# Altium project KATADC_V1-3.PrjPCB (part 1 of 3)
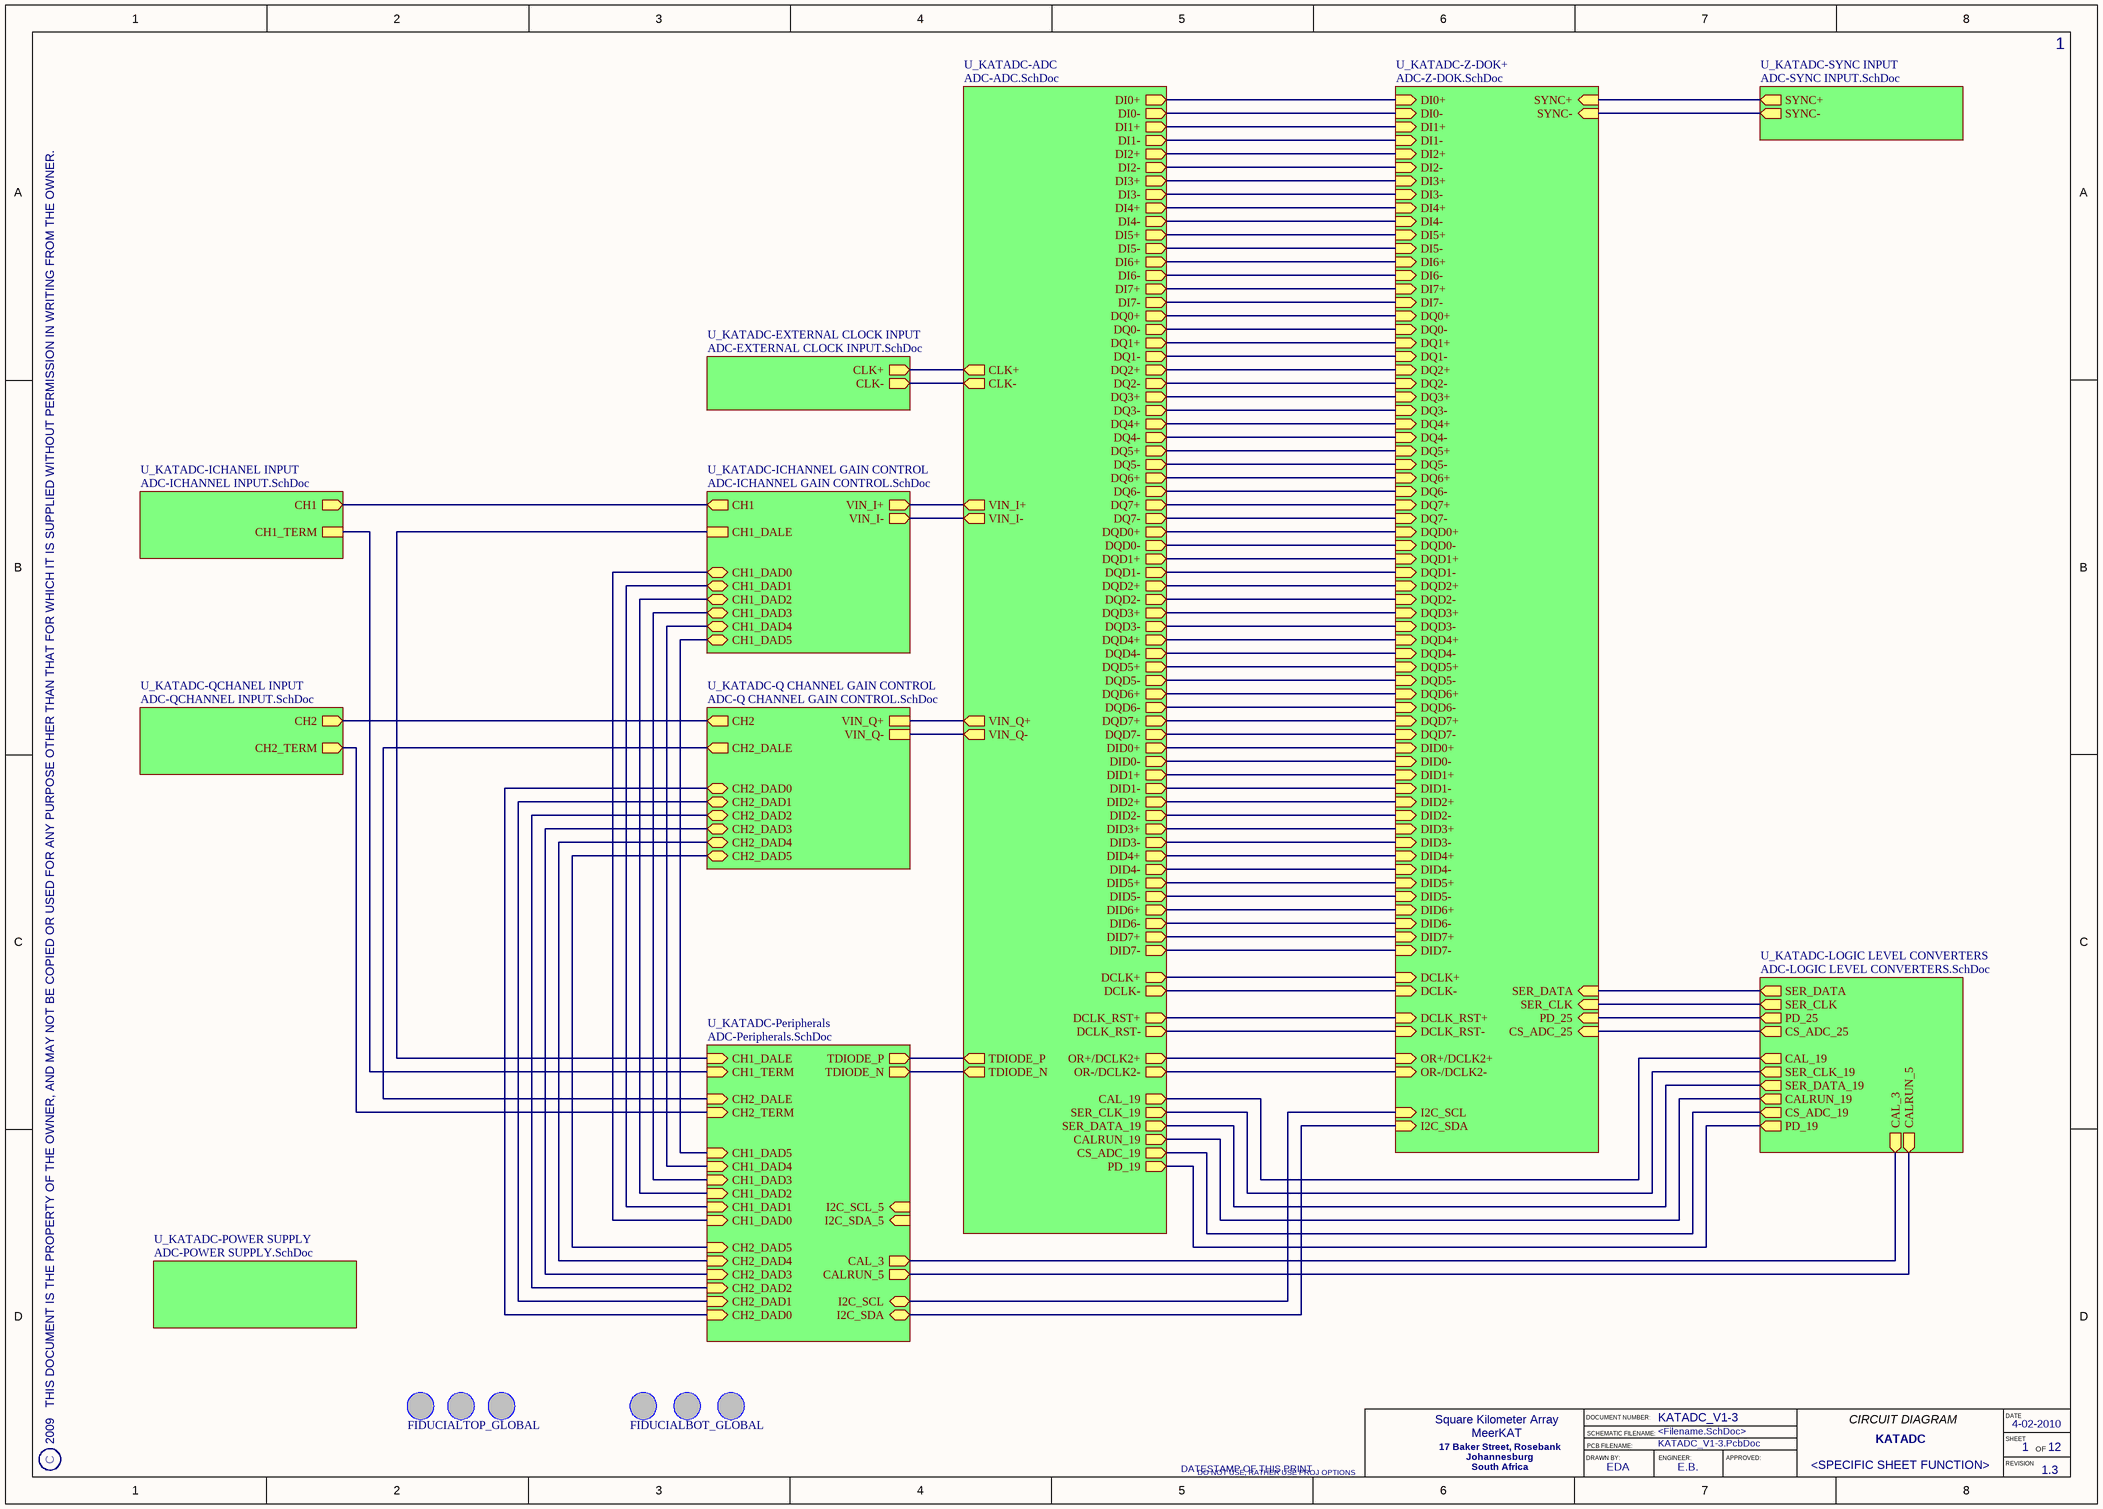
[diagram p0: ADC-TopSheet.SchDoc]
COMPANY_ADDRESS_1: 17 Baker Street, Rosebank; COMPANY_ADDRESS_2: Johannesburg; COMPANY_ADDRESS_3: South Africa; COMPANY_NAME1: Square Kilometer Array; COMPANY_NAME2: MeerKAT; COPYRIGHT_YEAR: 2010; GERBER FILENAME: KATADC_V1-3; PCB_REVISION: 1.3; PCB_Title_Date: 01-06-2010; PCB_Title_Description: SKA ADC PCB; PCB_Title_DocumentNumber: KATADC_V1-3; PCB_Title_DrawnBy: EDA; PCB_Title_Engineer: E.B.; PCB_Title_Filename: KATADC_V1-3.PcbDoc; PROJECT_Filename: KATADC_V1-3.PrjPCB; PROJECT_TITLE: KATADC; SCH_Title_Date: 4-02-2010; SCH_Title_DocumentNumber: KATADC_V1-3; SCH_Title_DrawnBy: EDA; SCH_Title_Engineer: E.B.
12 sheets, 188 parts. Net scope: hierarchical (ports join the sheet entries above them; power ports are global).
Board file: KATADC_V1-3.PcbDoc
Sheets:
  ADC-TopSheet.SchDoc
    U_KATADC-EXTERNAL CLOCK INPUT = ADC-EXTERNAL CLOCK INPUT.SchDoc
    U_KATADC-ICHANEL INPUT = ADC-ICHANNEL INPUT.SchDoc
    U_KATADC-ICHANNEL GAIN CONTROL = ADC-ICHANNEL GAIN CONTROL.SchDoc
    U_KATADC-LOGIC LEVEL CONVERTERS = ADC-LOGIC LEVEL CONVERTERS.SchDoc
    U_KATADC-Peripherals = ADC-Peripherals.SchDoc
    U_KATADC-QCHANEL INPUT = ADC-QCHANNEL INPUT.SchDoc
    U_KATADC-Q CHANNEL GAIN CONTROL = ADC-Q CHANNEL GAIN CONTROL.SchDoc
    U_KATADC-SYNC INPUT = ADC-SYNC INPUT.SchDoc
    U_KATADC-Z-DOK+ = ADC-Z-DOK.SchDoc
    U_KATADC-ADC = ADC-ADC.SchDoc
    U_KATADC-POWER SUPPLY = ADC-POWER SUPPLY.SchDoc

## Sheet ADC-TopSheet.SchDoc: <SPECIFIC SHEET FUNCTION>
size A3; Date: DO NOT USE, RATHER USE PROJ OPTIONS; DrawnBy: DO NOT USE, RATHER USE PROJ OPTIONS; Engineer: DO NOT USE, RATHER USE PROJ OPTIONS; Organization: DO NOT USE, RATHER USE PROJ OPTIONS; DocumentNumber: 1; Revision: DO NOT USE, RATHER USE PROJ OPTIONS; SheetNumber: 1; SheetTotal: 12; SCH_Sheet_Filename: <Filename.SchDoc>; CurrentTime: DO NOT USE, RATHER USE PROJ OPTIONS; Time: DO NOT USE, RATHER USE PROJ OPTIONS; DocumentFullPathAndName: DO NOT USE, RATHER USE PROJ OPTIONS; DocumentName: DO NOT USE, RATHER USE PROJ OPTIONS; ModifiedDate: DO NOT USE, RATHER USE PROJ OPTIONS; ImagePath: DO NOT USE, RATHER USE PROJ OPTIONS

### Parts
F1  FIDUCIALTOP_GLOBAL  [FiducialTop_Global]
F2  FIDUCIALTOP_GLOBAL  [FiducialTop_Global]  (value not drawn)
F3  FIDUCIALTOP_GLOBAL  [FiducialTop_Global]  (value not drawn)
F6  FIDUCIALBOT_GLOBAL  [FiducialBot_Global]
F7  FIDUCIALBOT_GLOBAL  [FiducialBot_Global]  (value not drawn)
F8  FIDUCIALBOT_GLOBAL  [FiducialBot_Global]  (value not drawn)

### Sub-sheets
U_KATADC-ADC = ADC-ADC.SchDoc: DI0+ (out), DI0- (out), DI1+ (out), DI1- (out), DI2+ (out), DI2- (out), DI3+ (out), DI3- (out), DI4+ (out), DI4- (out), DI5+ (out), DI5- (out), DI6+ (out), DI6- (out), DI7+ (out), DI7- (out), DQ0+ (out), DQ0- (out), DQ1+ (out), DQ1- (out), DQ2+ (out), DQ2- (out), DQ3+ (out), DQ3- (out), DQ4+ (out), DQ4- (out), DQ5+ (out), DQ5- (out), DQ6+ (out), DQ6- (out), DQ7+ (out), DQ7- (out), DQD0+ (out), DQD0- (out), DQD1+ (out), DQD1- (out), DQD2+ (out), DQD2- (out), DQD3+ (out), DQD3- (out), DQD4+ (out), DQD4- (out), DQD5+ (out), DQD5- (out), DQD6+ (out), DQD6- (out), DQD7+ (out), DQD7- (out), DID0+ (out), DID0- (out), DID1+ (out), DID1- (out), DID2+ (out), DID2- (out), DID3+ (out), DID3- (out), DID4+ (out), DID4- (out), DID5+ (out), DID5- (out), DID6+ (out), DID6- (out), DID7+ (out), DID7- (out), TDIODE_P (out), TDIODE_N (out), VIN_I+ (out), VIN_I- (out), VIN_Q+ (out), VIN_Q- (out), PD_19 (out), DCLK_RST- (out), SER_CLK_19 (out), CLK+ (out), CLK- (out), SER_DATA_19 (out), DCLK_RST+ (out), CAL_19 (out), CS_ADC_19 (out), CALRUN_19 (out), OR+/DCLK2+ (out), OR-/DCLK2- (out), DCLK+ (out), DCLK- (out)
U_KATADC-EXTERNAL CLOCK INPUT = ADC-EXTERNAL CLOCK INPUT.SchDoc: CLK+ (out), CLK- (out)
U_KATADC-ICHANEL INPUT = ADC-ICHANNEL INPUT.SchDoc: CH1 (out), CH1_TERM
U_KATADC-ICHANNEL GAIN CONTROL = ADC-ICHANNEL GAIN CONTROL.SchDoc: VIN_I+ (out), VIN_I- (out), CH1 (out), CH1_DALE, CH1_DAD0, CH1_DAD1, CH1_DAD2, CH1_DAD3, CH1_DAD4, CH1_DAD5
U_KATADC-LOGIC LEVEL CONVERTERS = ADC-LOGIC LEVEL CONVERTERS.SchDoc: SER_DATA (out), SER_CLK (out), SER_DATA_19 (out), SER_CLK_19 (out), CALRUN_19 (out), CALRUN_5 (out), CAL_3 (out), CAL_19 (out), CS_ADC_25 (out), PD_25 (out), CS_ADC_19 (out), PD_19 (out)
U_KATADC-Peripherals = ADC-Peripherals.SchDoc: I2C_SDA_5 (in), I2C_SCL_5 (in), CH2_DAD0 (in), CH2_DAD1 (in), CH2_DAD2 (in), CH2_DAD3 (in), CH2_DAD4 (in), CH2_DAD5 (in), CH2_DALE (in), CH2_TERM (in), CAL_3 (out), CH1_DAD0 (in), CH1_DAD1 (in), CH1_DAD2 (in), CH1_DAD3 (in), CH1_DAD4 (in), CH1_DAD5 (in), CH1_DALE (in), CH1_TERM (in), CALRUN_5 (out), TDIODE_P (out), TDIODE_N (out), I2C_SDA, I2C_SCL
U_KATADC-POWER SUPPLY = ADC-POWER SUPPLY.SchDoc: no entries
U_KATADC-Q CHANNEL GAIN CONTROL = ADC-Q CHANNEL GAIN CONTROL.SchDoc: VIN_Q+, VIN_Q-, CH2 (out), CH2_DALE (out), CH2_DAD0, CH2_DAD1, CH2_DAD2, CH2_DAD3, CH2_DAD4, CH2_DAD5
U_KATADC-QCHANEL INPUT = ADC-QCHANNEL INPUT.SchDoc: CH2 (out), CH2_TERM (out)
U_KATADC-SYNC INPUT = ADC-SYNC INPUT.SchDoc: SYNC+ (out), SYNC- (out)
U_KATADC-Z-DOK+ = ADC-Z-DOK.SchDoc: SER_CLK (in), DID1+ (in), DID1- (in), DID4+ (in), DI0+ (in), DI0- (in), DI4- (in), DCLK_RST+ (in), DCLK_RST- (in), DQ4+ (in), DQ4- (in), DQ0+ (in), DI4+ (in), DQ0- (in), DQD4+ (in), DQD4- (in), DQD0+ (in), DQD0- (in), DID4- (in), SER_DATA (in), DID0+ (in), DID0- (in), DID3+ (in), DID7+ (in), DID7- (in), DI3- (in), DI7+ (in), DI7- (in), DQ5+ (in), DQ5- (in), DQ1+ (in), DI3+ (in), DQ1- (in), DQD5+ (in), DQD5- (in), DQD1+ (in), DQD1- (in), DID3- (in), I2C_SDA (in), OR-/DCLK2- (in), OR+/DCLK2+ (in), DQD3- (in), DQD3+ (in), DQD7- (in), DQD7+ (in), DQ3- (in), CS_ADC_25 (in), I2C_SCL (in), SYNC+ (in), SYNC- (in), DID5+ (in), DID5- (in), DI1+ (in), DI1- (in), DI5+ (in), DI5- (in), DQ7+ (in), DQ7- (in), DQ3+ (in), DCLK- (in), DCLK+ (in), DQD2- (in), DQD2+ (in), DQD6- (in), DQD6+ (in), DQ2- (in), PD_25 (in), DID2+ (in), DID2- (in), DID6+ (in), DID6- (in), DI2+ (in), DI2- (in), DI6+ (in), DI6- (in), DQ6+ (in), DQ6- (in), DQ2+ (in)

### Nets
CAL_3: sheet U_KATADC-LOGIC LEVEL CONVERTERS/CAL_3, sheet U_KATADC-Peripherals/CAL_3
CAL_19: sheet U_KATADC-LOGIC LEVEL CONVERTERS/CAL_19, sheet U_KATADC-ADC/CAL_19
CALRUN_5: sheet U_KATADC-LOGIC LEVEL CONVERTERS/CALRUN_5, sheet U_KATADC-Peripherals/CALRUN_5
CALRUN_19: sheet U_KATADC-LOGIC LEVEL CONVERTERS/CALRUN_19, sheet U_KATADC-ADC/CALRUN_19
CH1: sheet U_KATADC-ICHANEL INPUT/CH1, sheet U_KATADC-ICHANNEL GAIN CONTROL/CH1
CH1_DAD0: sheet U_KATADC-ICHANNEL GAIN CONTROL/CH1_DAD0, sheet U_KATADC-Peripherals/CH1_DAD0
CH1_DAD1: sheet U_KATADC-ICHANNEL GAIN CONTROL/CH1_DAD1, sheet U_KATADC-Peripherals/CH1_DAD1
CH1_DAD2: sheet U_KATADC-ICHANNEL GAIN CONTROL/CH1_DAD2, sheet U_KATADC-Peripherals/CH1_DAD2
CH1_DAD3: sheet U_KATADC-ICHANNEL GAIN CONTROL/CH1_DAD3, sheet U_KATADC-Peripherals/CH1_DAD3
CH1_DAD4: sheet U_KATADC-ICHANNEL GAIN CONTROL/CH1_DAD4, sheet U_KATADC-Peripherals/CH1_DAD4
CH1_DAD5: sheet U_KATADC-ICHANNEL GAIN CONTROL/CH1_DAD5, sheet U_KATADC-Peripherals/CH1_DAD5
CH1_DALE: sheet U_KATADC-ICHANNEL GAIN CONTROL/CH1_DALE, sheet U_KATADC-Peripherals/CH1_DALE
CH1_TERM: sheet U_KATADC-ICHANEL INPUT/CH1_TERM, sheet U_KATADC-Peripherals/CH1_TERM
CH2: sheet U_KATADC-QCHANEL INPUT/CH2, sheet U_KATADC-Q CHANNEL GAIN CONTROL/CH2
CH2_DAD0: sheet U_KATADC-Peripherals/CH2_DAD0, sheet U_KATADC-Q CHANNEL GAIN CONTROL/CH2_DAD0
CH2_DAD1: sheet U_KATADC-Peripherals/CH2_DAD1, sheet U_KATADC-Q CHANNEL GAIN CONTROL/CH2_DAD1
CH2_DAD2: sheet U_KATADC-Peripherals/CH2_DAD2, sheet U_KATADC-Q CHANNEL GAIN CONTROL/CH2_DAD2
CH2_DAD3: sheet U_KATADC-Peripherals/CH2_DAD3, sheet U_KATADC-Q CHANNEL GAIN CONTROL/CH2_DAD3
CH2_DAD4: sheet U_KATADC-Peripherals/CH2_DAD4, sheet U_KATADC-Q CHANNEL GAIN CONTROL/CH2_DAD4
CH2_DAD5: sheet U_KATADC-Peripherals/CH2_DAD5, sheet U_KATADC-Q CHANNEL GAIN CONTROL/CH2_DAD5
CH2_DALE: sheet U_KATADC-Peripherals/CH2_DALE, sheet U_KATADC-Q CHANNEL GAIN CONTROL/CH2_DALE
CH2_TERM: sheet U_KATADC-Peripherals/CH2_TERM, sheet U_KATADC-QCHANEL INPUT/CH2_TERM
CLK+: sheet U_KATADC-EXTERNAL CLOCK INPUT/CLK+, sheet U_KATADC-ADC/CLK+
CLK-: sheet U_KATADC-EXTERNAL CLOCK INPUT/CLK-, sheet U_KATADC-ADC/CLK-
CS_ADC_19: sheet U_KATADC-LOGIC LEVEL CONVERTERS/CS_ADC_19, sheet U_KATADC-ADC/CS_ADC_19
CS_ADC_25: sheet U_KATADC-LOGIC LEVEL CONVERTERS/CS_ADC_25, sheet U_KATADC-Z-DOK+/CS_ADC_25
DCLK+: sheet U_KATADC-Z-DOK+/DCLK+, sheet U_KATADC-ADC/DCLK+
DCLK-: sheet U_KATADC-Z-DOK+/DCLK-, sheet U_KATADC-ADC/DCLK-
DCLK_RST+: sheet U_KATADC-Z-DOK+/DCLK_RST+, sheet U_KATADC-ADC/DCLK_RST+
DCLK_RST-: sheet U_KATADC-Z-DOK+/DCLK_RST-, sheet U_KATADC-ADC/DCLK_RST-
DI0+: sheet U_KATADC-Z-DOK+/DI0+, sheet U_KATADC-ADC/DI0+
DI0-: sheet U_KATADC-Z-DOK+/DI0-, sheet U_KATADC-ADC/DI0-
DI1+: sheet U_KATADC-Z-DOK+/DI1+, sheet U_KATADC-ADC/DI1+
DI1-: sheet U_KATADC-Z-DOK+/DI1-, sheet U_KATADC-ADC/DI1-
DI2+: sheet U_KATADC-Z-DOK+/DI2+, sheet U_KATADC-ADC/DI2+
DI2-: sheet U_KATADC-Z-DOK+/DI2-, sheet U_KATADC-ADC/DI2-
DI3+: sheet U_KATADC-Z-DOK+/DI3+, sheet U_KATADC-ADC/DI3+
DI3-: sheet U_KATADC-Z-DOK+/DI3-, sheet U_KATADC-ADC/DI3-
DI4+: sheet U_KATADC-Z-DOK+/DI4+, sheet U_KATADC-ADC/DI4+
DI4-: sheet U_KATADC-Z-DOK+/DI4-, sheet U_KATADC-ADC/DI4-
DI5+: sheet U_KATADC-Z-DOK+/DI5+, sheet U_KATADC-ADC/DI5+
DI5-: sheet U_KATADC-Z-DOK+/DI5-, sheet U_KATADC-ADC/DI5-
DI6+: sheet U_KATADC-Z-DOK+/DI6+, sheet U_KATADC-ADC/DI6+
DI6-: sheet U_KATADC-Z-DOK+/DI6-, sheet U_KATADC-ADC/DI6-
DI7+: sheet U_KATADC-Z-DOK+/DI7+, sheet U_KATADC-ADC/DI7+
DI7-: sheet U_KATADC-Z-DOK+/DI7-, sheet U_KATADC-ADC/DI7-
DID0+: sheet U_KATADC-Z-DOK+/DID0+, sheet U_KATADC-ADC/DID0+
DID0-: sheet U_KATADC-Z-DOK+/DID0-, sheet U_KATADC-ADC/DID0-
DID1+: sheet U_KATADC-Z-DOK+/DID1+, sheet U_KATADC-ADC/DID1+
DID1-: sheet U_KATADC-Z-DOK+/DID1-, sheet U_KATADC-ADC/DID1-
DID2+: sheet U_KATADC-Z-DOK+/DID2+, sheet U_KATADC-ADC/DID2+
DID2-: sheet U_KATADC-Z-DOK+/DID2-, sheet U_KATADC-ADC/DID2-
DID3+: sheet U_KATADC-Z-DOK+/DID3+, sheet U_KATADC-ADC/DID3+
DID3-: sheet U_KATADC-Z-DOK+/DID3-, sheet U_KATADC-ADC/DID3-
DID4+: sheet U_KATADC-Z-DOK+/DID4+, sheet U_KATADC-ADC/DID4+
DID4-: sheet U_KATADC-Z-DOK+/DID4-, sheet U_KATADC-ADC/DID4-
DID5+: sheet U_KATADC-Z-DOK+/DID5+, sheet U_KATADC-ADC/DID5+
DID5-: sheet U_KATADC-Z-DOK+/DID5-, sheet U_KATADC-ADC/DID5-
DID6+: sheet U_KATADC-Z-DOK+/DID6+, sheet U_KATADC-ADC/DID6+
DID6-: sheet U_KATADC-Z-DOK+/DID6-, sheet U_KATADC-ADC/DID6-
DID7+: sheet U_KATADC-Z-DOK+/DID7+, sheet U_KATADC-ADC/DID7+
DID7-: sheet U_KATADC-Z-DOK+/DID7-, sheet U_KATADC-ADC/DID7-
DQ0+: sheet U_KATADC-Z-DOK+/DQ0+, sheet U_KATADC-ADC/DQ0+
DQ0-: sheet U_KATADC-Z-DOK+/DQ0-, sheet U_KATADC-ADC/DQ0-
DQ1+: sheet U_KATADC-Z-DOK+/DQ1+, sheet U_KATADC-ADC/DQ1+
DQ1-: sheet U_KATADC-Z-DOK+/DQ1-, sheet U_KATADC-ADC/DQ1-
DQ2+: sheet U_KATADC-Z-DOK+/DQ2+, sheet U_KATADC-ADC/DQ2+
DQ2-: sheet U_KATADC-Z-DOK+/DQ2-, sheet U_KATADC-ADC/DQ2-
DQ3+: sheet U_KATADC-Z-DOK+/DQ3+, sheet U_KATADC-ADC/DQ3+
DQ3-: sheet U_KATADC-Z-DOK+/DQ3-, sheet U_KATADC-ADC/DQ3-
DQ4+: sheet U_KATADC-Z-DOK+/DQ4+, sheet U_KATADC-ADC/DQ4+
DQ4-: sheet U_KATADC-Z-DOK+/DQ4-, sheet U_KATADC-ADC/DQ4-
DQ5+: sheet U_KATADC-Z-DOK+/DQ5+, sheet U_KATADC-ADC/DQ5+
DQ5-: sheet U_KATADC-Z-DOK+/DQ5-, sheet U_KATADC-ADC/DQ5-
DQ6+: sheet U_KATADC-Z-DOK+/DQ6+, sheet U_KATADC-ADC/DQ6+
DQ6-: sheet U_KATADC-Z-DOK+/DQ6-, sheet U_KATADC-ADC/DQ6-
DQ7+: sheet U_KATADC-Z-DOK+/DQ7+, sheet U_KATADC-ADC/DQ7+
DQ7-: sheet U_KATADC-Z-DOK+/DQ7-, sheet U_KATADC-ADC/DQ7-
DQD0+: sheet U_KATADC-Z-DOK+/DQD0+, sheet U_KATADC-ADC/DQD0+
DQD0-: sheet U_KATADC-Z-DOK+/DQD0-, sheet U_KATADC-ADC/DQD0-
DQD1+: sheet U_KATADC-Z-DOK+/DQD1+, sheet U_KATADC-ADC/DQD1+
DQD1-: sheet U_KATADC-Z-DOK+/DQD1-, sheet U_KATADC-ADC/DQD1-
DQD2+: sheet U_KATADC-Z-DOK+/DQD2+, sheet U_KATADC-ADC/DQD2+
DQD2-: sheet U_KATADC-Z-DOK+/DQD2-, sheet U_KATADC-ADC/DQD2-
DQD3+: sheet U_KATADC-Z-DOK+/DQD3+, sheet U_KATADC-ADC/DQD3+
DQD3-: sheet U_KATADC-Z-DOK+/DQD3-, sheet U_KATADC-ADC/DQD3-
DQD4+: sheet U_KATADC-Z-DOK+/DQD4+, sheet U_KATADC-ADC/DQD4+
DQD4-: sheet U_KATADC-Z-DOK+/DQD4-, sheet U_KATADC-ADC/DQD4-
DQD5+: sheet U_KATADC-Z-DOK+/DQD5+, sheet U_KATADC-ADC/DQD5+
DQD5-: sheet U_KATADC-Z-DOK+/DQD5-, sheet U_KATADC-ADC/DQD5-
DQD6+: sheet U_KATADC-Z-DOK+/DQD6+, sheet U_KATADC-ADC/DQD6+
DQD6-: sheet U_KATADC-Z-DOK+/DQD6-, sheet U_KATADC-ADC/DQD6-
DQD7+: sheet U_KATADC-Z-DOK+/DQD7+, sheet U_KATADC-ADC/DQD7+
DQD7-: sheet U_KATADC-Z-DOK+/DQD7-, sheet U_KATADC-ADC/DQD7-
I2C_SCL: sheet U_KATADC-Peripherals/I2C_SCL, sheet U_KATADC-Z-DOK+/I2C_SCL
I2C_SDA: sheet U_KATADC-Peripherals/I2C_SDA, sheet U_KATADC-Z-DOK+/I2C_SDA
OR+/DCLK2+: sheet U_KATADC-Z-DOK+/OR+/DCLK2+, sheet U_KATADC-ADC/OR+/DCLK2+
OR-/DCLK2-: sheet U_KATADC-Z-DOK+/OR-/DCLK2-, sheet U_KATADC-ADC/OR-/DCLK2-
PD_19: sheet U_KATADC-LOGIC LEVEL CONVERTERS/PD_19, sheet U_KATADC-ADC/PD_19
PD_25: sheet U_KATADC-LOGIC LEVEL CONVERTERS/PD_25, sheet U_KATADC-Z-DOK+/PD_25
SER_CLK: sheet U_KATADC-LOGIC LEVEL CONVERTERS/SER_CLK, sheet U_KATADC-Z-DOK+/SER_CLK
SER_CLK_19: sheet U_KATADC-LOGIC LEVEL CONVERTERS/SER_CLK_19, sheet U_KATADC-ADC/SER_CLK_19
SER_DATA: sheet U_KATADC-LOGIC LEVEL CONVERTERS/SER_DATA, sheet U_KATADC-Z-DOK+/SER_DATA
SER_DATA_19: sheet U_KATADC-LOGIC LEVEL CONVERTERS/SER_DATA_19, sheet U_KATADC-ADC/SER_DATA_19
SYNC+: sheet U_KATADC-SYNC INPUT/SYNC+, sheet U_KATADC-Z-DOK+/SYNC+
SYNC-: sheet U_KATADC-SYNC INPUT/SYNC-, sheet U_KATADC-Z-DOK+/SYNC-
TDIODE_N: sheet U_KATADC-Peripherals/TDIODE_N, sheet U_KATADC-ADC/TDIODE_N
TDIODE_P: sheet U_KATADC-Peripherals/TDIODE_P, sheet U_KATADC-ADC/TDIODE_P
VIN_I+: sheet U_KATADC-ICHANNEL GAIN CONTROL/VIN_I+, sheet U_KATADC-ADC/VIN_I+
VIN_I-: sheet U_KATADC-ICHANNEL GAIN CONTROL/VIN_I-, sheet U_KATADC-ADC/VIN_I-
VIN_Q+: sheet U_KATADC-Q CHANNEL GAIN CONTROL/VIN_Q+, sheet U_KATADC-ADC/VIN_Q+
VIN_Q-: sheet U_KATADC-Q CHANNEL GAIN CONTROL/VIN_Q-, sheet U_KATADC-ADC/VIN_Q-

### Notes on the sheet
- 2009   THIS DOCUMENT IS THE PROPERTY OF THE OWNER, AND MAY NOT BE COPIED OR USED FOR ANY PURPOSE OTHER THAN THAT FOR WHICH IT IS SUPPLIED WITHOUT PERMISSION IN WRITING FROM THE OWNER.
- C
- DATESTAMP OF THIS PRINT
- DRAWN BY:
- DOCUMENT NUMBER:
- SCHEMATIC FILENAME:
- PCB FILENAME:
- ENGINEER:
- APPROVED:
- CIRCUIT DIAGRAM
- DATE
- SHEET
- REVISION
- OF

### Library data of the parts
F1-F3 = FIDUCIALTOP_GLOBAL: Value: ????; Manufacturer: *; Manufacturer_PN: *; Created_By: *; Checked_By: *; Checked_Date: *; HelpURL: *; ComponentLink1Description: Footprint Detail; ComponentLink1URL: *; ComponentLink2Description: Application Note; ComponentLink2URL: *; ComponentLink3Description: Layout Guidelines; ComponentLink3URL: *; ComponentLink4Description: Technology Reference; ComponentLink4URL: *; Supplier1: *; Supplier2: *; Unit_Cost: *; MOQ: *; Leadtime: *; Inventory_Stock: *; Tolerance: *; Wattage: *; Voltage: *; Package: *; ComponentLink5Description: Production Detail; ComponentLink5URL: *; Note: *; Stock Code: *
F6-F8 = FIDUCIALBOT_GLOBAL: Value: ????; Manufacturer: *; Manufacturer_PN: *; Created_By: *; Checked_By: *; Checked_Date: *; HelpURL: *; ComponentLink1Description: Footprint Detail; ComponentLink1URL: *; ComponentLink2Description: Application Note; ComponentLink2URL: *; ComponentLink3Description: Layout Guidelines; ComponentLink3URL: *; ComponentLink4Description: Technology Reference; ComponentLink4URL: *; Supplier1: *; Supplier2: *; Unit_Cost: *; MOQ: *; Leadtime: *; Inventory_Stock: *; Tolerance: *; Wattage: *; Voltage: *; Package: *; ComponentLink5Description: Production Detail; ComponentLink5URL: *; Note: *; Stock Code: *

## Sheet ADC-EXTERNAL CLOCK INPUT.SchDoc: <SPECIFIC SHEET FUNCTION>
size A3; Date: DO NOT USE, RATHER USE PROJ OPTIONS; DrawnBy: DO NOT USE, RATHER USE PROJ OPTIONS; Engineer: DO NOT USE, RATHER USE PROJ OPTIONS; Organization: DO NOT USE, RATHER USE PROJ OPTIONS; DocumentNumber: 3; Revision: DO NOT USE, RATHER USE PROJ OPTIONS; SheetNumber: 3; SheetTotal: 12; SCH_Sheet_Filename: ADC-EXTERNAL CLOCK INPUT.SchDoc; CurrentTime: DO NOT USE, RATHER USE PROJ OPTIONS; Time: DO NOT USE, RATHER USE PROJ OPTIONS; DocumentFullPathAndName: DO NOT USE, RATHER USE PROJ OPTIONS; DocumentName: DO NOT USE, RATHER USE PROJ OPTIONS; ModifiedDate: DO NOT USE, RATHER USE PROJ OPTIONS; ImagePath: DO NOT USE, RATHER USE PROJ OPTIONS
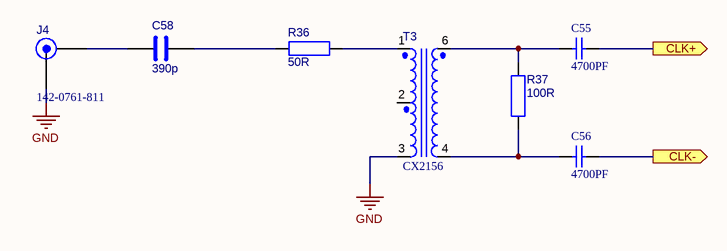
[diagram p1: ADC-EXTERNAL CLOCK INPUT.SchDoc]

### Parts
C55  value 4700PF  [CAPC1005X55N]  (hidden comment: Capacitor 0402 SMD)
C56  value 4700PF  [CAPC1005X55N]  (hidden comment: Capacitor 0402 SMD)
C58  value 390p  [CAPC1005X55N]  (hidden comment: *)
J4  (no value)  [EDGE_LAUNCH_TH_SMA]
R36  50R  [RESC1005X40N]
R37  100R  [RESC1005X40N]
T3  CX2156  [PULSE_KAYAK]

### Ports
CLK+ (out), CLK- (out)

### Nets
GND: J4.2 T3.3
CLK+: C55.2 ; port CLK+
CLK-: C56.2 ; port CLK-
NetC55_1: C55.1 R37.1 T3.6
NetC56_1: C56.1 R37.2 T3.4
NetC58_1: C58.1 J4.1
NetC58_2: C58.2 R36.1
NetR36_2: R36.2 T3.1

Not connected (* = marked no-connect by the designer): T3 2

### Notes on the sheet
- 2009   THIS DOCUMENT IS THE PROPERTY OF THE OWNER, AND MAY NOT BE COPIED OR USED FOR ANY PURPOSE OTHER THAN THAT FOR WHICH IT IS SUPPLIED WITHOUT PERMISSION IN WRITING FROM THE OWNER.
- C
- DATESTAMP OF THIS PRINT
- DRAWN BY:
- DOCUMENT NUMBER:
- SCHEMATIC FILENAME:
- PCB FILENAME:
- ENGINEER:
- APPROVED:
- CIRCUIT DIAGRAM
- DATE
- SHEET
- REVISION
- OF

### Library data of the parts
C55 C56 = cap0402: Created_By: EDA-ASA; Checked_By: *; Checked_Date: *; HelpURL: *; Supplier1: *; Supplier2: *; Unit_Cost: *; MOQ: *; Leadtime: *; Inventory_Stock: *; Tolerance: *; Wattage: *; Package: 0402; ComponentLinked1Description: *; ComponentLinked1URL: *; ComponentLinked2Description: *; ComponentLinked2URL: *; ComponentLinked3Description: *; ComponentLinked3URL: *; ComponentLinked4Description: *; ComponentLinked4URL: *
C58 = CAP-0603: CAP SMD 0603; Manufacturer: *; Manufacturer_PN: *; Created_By: *; Checked_By: *; Checked_Date: *; HelpURL: *; ComponentLink1Description: Footprint Detail; ComponentLink1URL: *; ComponentLink2Description: Application Note; ComponentLink2URL: *; ComponentLink3Description: Layout Guidelines; ComponentLink3URL: *; ComponentLink4Description: Technology Reference; ComponentLink4URL: *; Supplier1: *; Supplier2: *; Unit_Cost: *; MOQ: *; Leadtime: *; Inventory_Stock: *; Tolerance: *; Wattage: *; Voltage: *; Package: 0603; ComponentLink5Description: Production Detail; ComponentLink5URL: *; Note: *; Stock Code: *
J4 = 142-0761-811: High Frequency SMA End Lauch Connector; Manufacturer: JOHNSON; Created_By: CT; Voltage: ???; Checked_By: *; Checked_Date: *; HelpURL: *; ComponentLink1Description: High Frequency SMA End Lauch Connector; ComponentLink1URL: *; ComponentLink2Description: Application Note; ComponentLink2URL: *; ComponentLink3Description: Layout Guidelines; ComponentLink3URL: *; ComponentLink4Description: Technology Reference; ComponentLink4URL: *; Supplier1: *; Supplier2: *; Unit_Cost: *; MOQ: *; Leadtime: *; Inventory_Stock: *; Tolerance: *; Wattage: *; Package: *; ComponentLink5Description: Production Detail; ComponentLink5URL: *; Note: *; Stock Code: *; Manufacturer_PN: 142-0761-811
R36 R37 = RES-0805: RESISTOR SMD 0805; Checked_By: NN; Manufacturer: *; Manufacturer_PN: *; Created_By: *; Checked_Date: 5-08-2009; HelpURL: *; ComponentLink1Description: Footprint Detail; ComponentLink1URL: *; ComponentLink2Description: Application Note; ComponentLink2URL: *; ComponentLink3Description: Layout Guidelines; ComponentLink3URL: *; ComponentLink4Description: Technology Reference; ComponentLink4URL: *; Supplier1: *; Supplier2: *; Unit_Cost: *; MOQ: *; Leadtime: *; Inventory_Stock: *; Tolerance: *; Wattage: *; Voltage: *; Package: 0805; ComponentLink5Description: Production Detail; ComponentLink5URL: *; Note: *; Stock Code: *
  R36: Value: 50R
  R37: Value: 100R
T3 = CX2156: TRANSFORMER WIDEBAND RF APPLICATION; Voltage: ???; Manufacturer: *; Created_By: *; Checked_By: *; Checked_Date: *; HelpURL: *; ComponentLink1Description: TRANSFORMER WIDEBAND RF APPLICATION; ComponentLink1URL: *; ComponentLink2Description: Application Note; ComponentLink2URL: *; ComponentLink3Description: Layout Guidelines; ComponentLink3URL: *; ComponentLink4Description: Technology Reference; ComponentLink4URL: *; Supplier1: *; Supplier2: *; Unit_Cost: *; MOQ: *; Leadtime: *; Inventory_Stock: *; Tolerance: *; Wattage: *; Package: *; ComponentLink5Description: Production Detail; ComponentLink5URL: *; Note: *; Stock Code: *; Manufacturer_PN: CX2156

## Sheet ADC-ICHANNEL INPUT.SchDoc: <SPECIFIC SHEET FUNCTION>
size A3; Date: DO NOT USE, RATHER USE PROJ OPTIONS; DrawnBy: DO NOT USE, RATHER USE PROJ OPTIONS; Engineer: DO NOT USE, RATHER USE PROJ OPTIONS; Organization: DO NOT USE, RATHER USE PROJ OPTIONS; DocumentNumber: 4; Revision: DO NOT USE, RATHER USE PROJ OPTIONS; SheetNumber: 4; SheetTotal: 12; SCH_Sheet_Filename: ADC-ICHANNEL INPUT.SchDoc; CurrentTime: DO NOT USE, RATHER USE PROJ OPTIONS; Time: DO NOT USE, RATHER USE PROJ OPTIONS; DocumentFullPathAndName: DO NOT USE, RATHER USE PROJ OPTIONS; DocumentName: DO NOT USE, RATHER USE PROJ OPTIONS; ModifiedDate: DO NOT USE, RATHER USE PROJ OPTIONS; ImagePath: DO NOT USE, RATHER USE PROJ OPTIONS
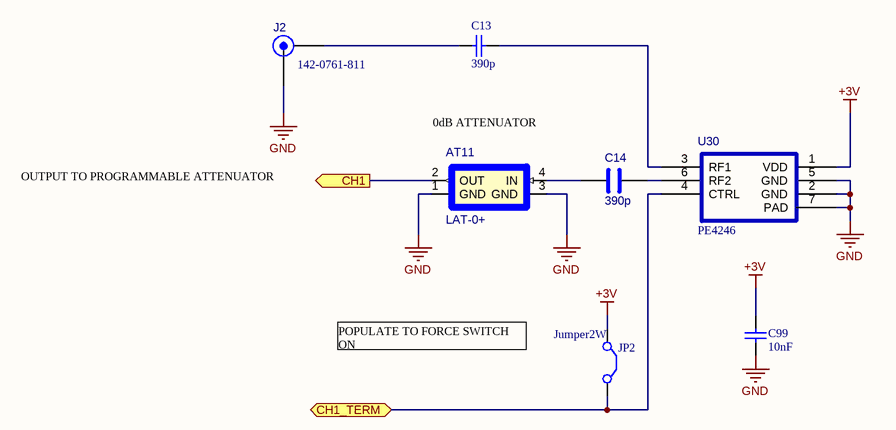
[diagram p2: ADC-ICHANNEL INPUT.SchDoc]

### Parts
AT11  (no value)  [MINICIRCUITS_MMM168]
C13  value 390p  [CAPC1005X55N]  (hidden comment: Capacitor 0402 SMD)
C14  value 390p  [CAPC1005X55N]  (hidden comment: Footprint ???)
C99  value 10nF  [CAPC1005X55N]  (hidden comment: Capacitor 0402 SMD)
J2  (no value)  [EDGE_LAUNCH_TH_SMA]
JP2  Jumper2W  [JUMPER]
U30  PE4246  [PSON95P300X300X90-7USR]

### Ports
CH1 (out), CH1_TERM

### Nets
+3V: C99.1 JP2.1(C1) U30.1(VDD)
GND: AT11.1(GND) AT11.3(GND) C99.2 J2.2 U30.2(GND) U30.5(GND) U30.7(PAD)
CH1: AT11.2(OUT) ; port CH1
CH1_TERM: JP2.2(C2) U30.4(CTRL) ; port CH1_TERM
NetAT11_4: AT11.4(IN) C14.2
NetC13_1: C13.1 J2.1
NetC13_2: C13.2 U30.3(RF1)
NetC14_1: C14.1 U30.6(RF2)

### Notes on the sheet
- (near AT11) 0dB ATTENUATOR
- OUTPUT TO PROGRAMMABLE ATTENUATOR
- POPULATE TO FORCE SWITCH ON
- 2009   THIS DOCUMENT IS THE PROPERTY OF THE OWNER, AND MAY NOT BE COPIED OR USED FOR ANY PURPOSE OTHER THAN THAT FOR WHICH IT IS SUPPLIED WITHOUT PERMISSION IN WRITING FROM THE OWNER.
- C
- DATESTAMP OF THIS PRINT
- DRAWN BY:
- DOCUMENT NUMBER:
- SCHEMATIC FILENAME:
- PCB FILENAME:
- ENGINEER:
- APPROVED:
- CIRCUIT DIAGRAM
- DATE
- SHEET
- REVISION
- OF

### Library data of the parts
AT11 = LAT-0+: Fixed Attenuator; Manufacturer: Mini-Circuits; Created_By: CT; Checked_By: *; Checked_Date: *; HelpURL: X:\Datasheets\By_Manufacturer\Mini Circuits\LAT-0+.pdf; ComponentLink1Description: Fixed Attenuator; ComponentLink1URL: *; ComponentLink2Description: Application Note; ComponentLink2URL: *; ComponentLink3Description: Layout Guidelines; ComponentLink3URL: *; ComponentLink4Description: Technology Reference; ComponentLink4URL: *; Supplier1: *; Supplier2: *; Unit_Cost: *; MOQ: *; Leadtime: *; Inventory_Stock: *; Tolerance: *; Wattage: *; Voltage: *; Package: *; ComponentLink5Description: Production Detail; ComponentLink5URL: *; Note: *; Stock Code: *; Manufacturer_PN: LAT-0+
C13 C99 = cap0402: Created_By: EDA-ASA; Checked_By: *; Checked_Date: *; HelpURL: *; Supplier1: *; Supplier2: *; Unit_Cost: *; MOQ: *; Leadtime: *; Inventory_Stock: *; Tolerance: *; Wattage: *; Package: 0402; ComponentLinked1Description: *; ComponentLinked1URL: *; ComponentLinked2Description: *; ComponentLinked2URL: *; ComponentLinked3Description: *; ComponentLinked3URL: *; ComponentLinked4Description: *; ComponentLinked4URL: *
C14 = CAP-0603: CAP SMD 0603; Manufacturer: *; Manufacturer_PN: *; Created_By: *; Checked_By: *; Checked_Date: *; HelpURL: *; ComponentLink1Description: Footprint Detail; ComponentLink1URL: *; ComponentLink2Description: Application Note; ComponentLink2URL: *; ComponentLink3Description: Layout Guidelines; ComponentLink3URL: *; ComponentLink4Description: Technology Reference; ComponentLink4URL: *; Supplier1: *; Supplier2: *; Unit_Cost: *; MOQ: *; Leadtime: *; Inventory_Stock: *; Tolerance: *; Wattage: *; Voltage: *; Package: 0603; ComponentLink5Description: Production Detail; ComponentLink5URL: *; Note: *; Stock Code: *
J2 = 142-0761-811: as J4 on sheet ADC-EXTERNAL CLOCK INPUT; Checked_By: *; Checked_Date: *; HelpURL: *; ComponentLink1Description: High Frequency SMA End Lauch Connector; ComponentLink1URL: *; ComponentLink2Description: Application Note; ComponentLink2URL: *; ComponentLink3Description: Layout Guidelines; ComponentLink3URL: *; ComponentLink4Description: Technology Reference; ComponentLink4URL: *; Supplier1: *; Supplier2: *; Unit_Cost: *; MOQ: *; Leadtime: *; Inventory_Stock: *; Tolerance: *; Wattage: *; Package: *; ComponentLink5Description: Production Detail; ComponentLink5URL: *; Note: *; Stock Code: *; Manufacturer_PN: 142-0761-811
JP2 = Jumper2W: Jumper Wire; Published: 24-Mar-1999; LatestRevisionDate: 17-Jul-2002; LatestRevisionNote: Re-released for DXP Platform.; PackageReference: RAD-0.2; Publisher: Altium Limited
U30 = PE4246: Absorptive SPST UltraCMOS RF Switch; Manufacturer: Pergrime Semiconductor; Created_By: IN; Manufacturer_PN: PE4246; Checked_By: *; Checked_Date: *; HelpURL: X:\Datasheets\By Manufacturer\Pergrime\pe4246ds.pdf; ComponentLink1Description: X:\Datasheets\By Manufacturer\Pergrime\pe4246ds.pdf#page=5; ComponentLink1URL: *; ComponentLink2Description: Application Note; ComponentLink2URL: *; ComponentLink3Description: Layout Guidelines; ComponentLink3URL: *; ComponentLink4Description: Technology Reference; ComponentLink4URL: *; Supplier1: *; Supplier2: *; Unit_Cost: *; MOQ: *; Leadtime: *; Inventory_Stock: *; Tolerance: *; Wattage: *; Voltage: *; Package: *; ComponentLink5Description: Production Detail; ComponentLink5URL: *; Note: *; Stock Code: *

## Sheet ADC-ICHANNEL GAIN CONTROL.SchDoc: <SPECIFIC SHEET FUNCTION>
size A3; Date: DO NOT USE, RATHER USE PROJ OPTIONS; DrawnBy: DO NOT USE, RATHER USE PROJ OPTIONS; Engineer: DO NOT USE, RATHER USE PROJ OPTIONS; Organization: DO NOT USE, RATHER USE PROJ OPTIONS; DocumentNumber: 7; Revision: DO NOT USE, RATHER USE PROJ OPTIONS; SheetNumber: 7; SheetTotal: 12; SCH_Sheet_Filename: ADC-ICHANNEL GAIN CONTROL.SchDoc; CurrentTime: DO NOT USE, RATHER USE PROJ OPTIONS; Time: DO NOT USE, RATHER USE PROJ OPTIONS; DocumentFullPathAndName: DO NOT USE, RATHER USE PROJ OPTIONS; DocumentName: DO NOT USE, RATHER USE PROJ OPTIONS; ModifiedDate: DO NOT USE, RATHER USE PROJ OPTIONS; ImagePath: DO NOT USE, RATHER USE PROJ OPTIONS
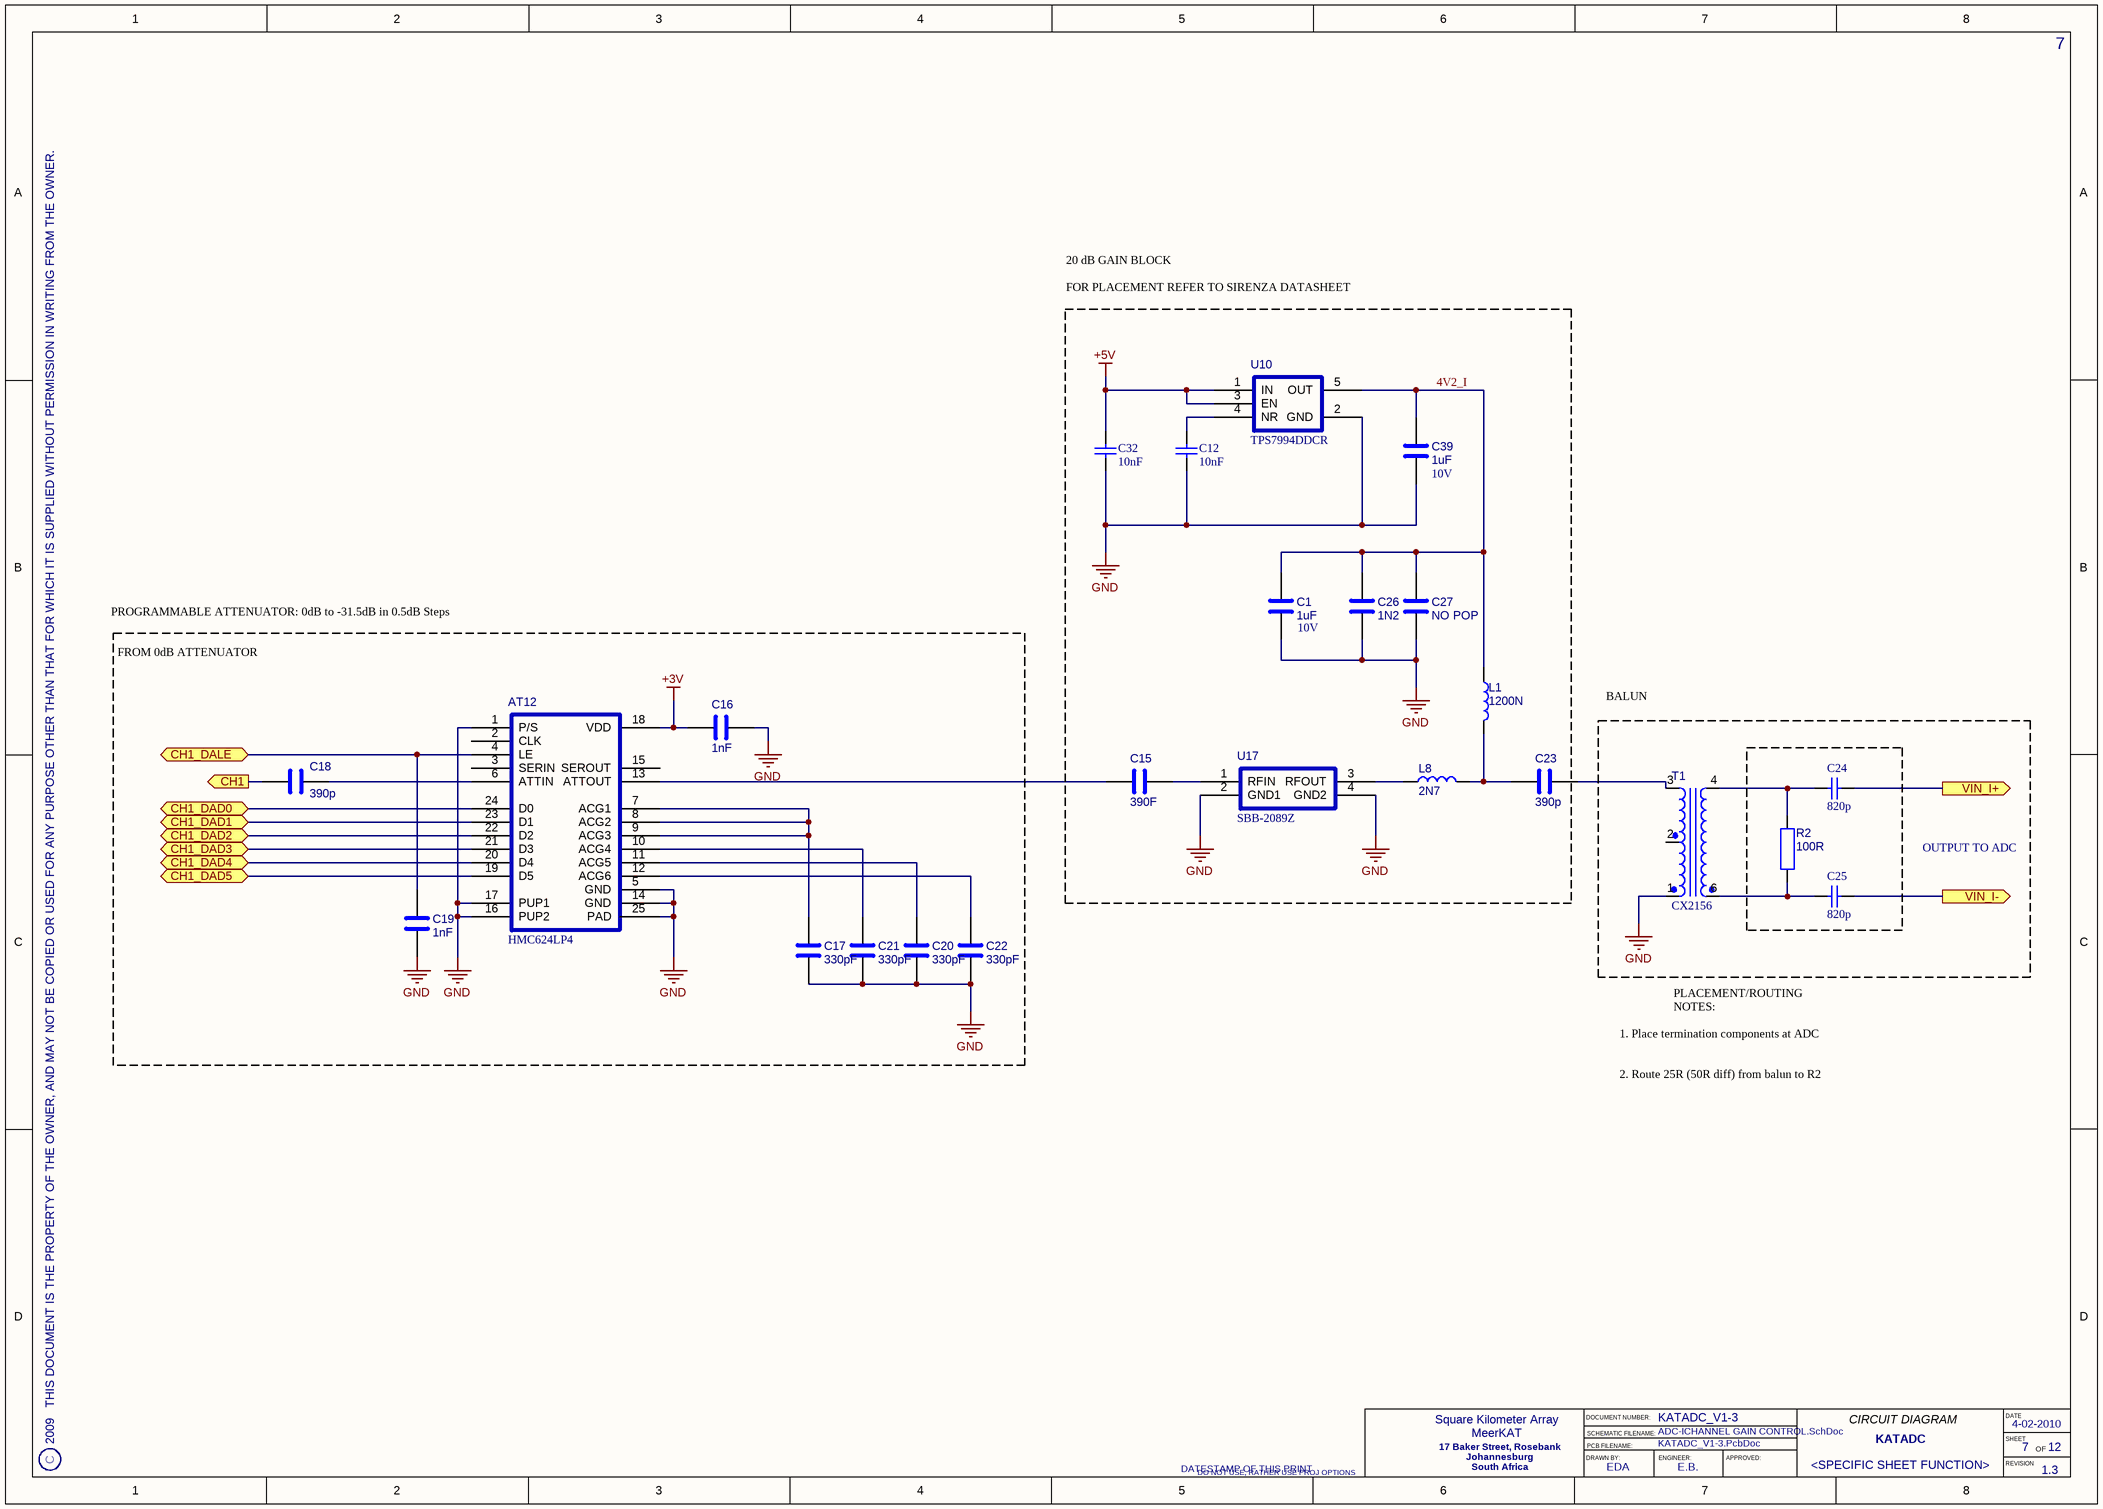
[diagram p3: ADC-ICHANNEL GAIN CONTROL.SchDoc]

### Parts
AT12  HMC624LP4  [QFN50P400X400X100-25USR]
C1  value 1uF  Voltage: 10V  [CAPC1632X80USR]  (hidden comment: Footprint ???)
C12  value 10nF  [CAPC1005X55N]  (hidden comment: Capacitor 0402 SMD)
C15  value 390F  [CAPC1005X55N]  (hidden comment: Footprint ???)
C16  value 1nF  [0603]  (hidden comment: Footprint ???)
C17  value 330pF  [0603]  (hidden comment: Footprint ???)
C18  value 390p  [CAPC1005X55N]  (hidden comment: *)
C19  value 1nF  [0603]  (hidden comment: *)
C20  value 330pF  [0603]  (hidden comment: Footprint ???)
C21  value 330pF  [0603]  (hidden comment: Footprint ???)
C22  value 330pF  [0603]  (hidden comment: Footprint ???)
C23  value 390p  [CAPC1005X55N]  (hidden comment: Footprint ???)
C24  value 820p  [CAPC1005X55N]  (hidden comment: Capacitor 0402 SMD)
C25  value 820p  [CAPC1005X55N]  (hidden comment: Capacitor 0402 SMD)
C26  value 1N2  [CAPC1005X55N]  (hidden comment: *)
C27  value NO POP  [CAPC1005X55N]  (hidden comment: Footprint ???)
C32  value 10nF  [CAPC1005X55N]  (hidden comment: Capacitor 0402 SMD)
C39  value 1uF  Voltage: 10V  [CAPC1632X80USR]  (hidden comment: Footprint ???)
L1  1200N  [INDM2520X160N]
L8  value 2N7  [INDC1005X60N]
R2  value 100R  [RESC1005X40N]  (hidden comment: *)
T1  CX2156  [PULSE_KAYAK]
U10  TPS7994DDCR  [SOT95P280X110-5USR2]
U17  SBB-2089Z  [SIRENZA_SOT89]

### Blocks framed on the sheet
OUTPUT TO ADC: C24 C25 R2 T1

### Ports
CH1 (out), CH1_DAD0, CH1_DAD1, CH1_DAD2, CH1_DAD3, CH1_DAD4, CH1_DAD5, CH1_DALE, VIN_I+ (out), VIN_I- (out)

### Nets
+3V: AT12.18(VDD) C16.1
+5V: C32.1 U10.1(IN) U10.3(EN)
GND: AT12.1(P/S) AT12.5(GND) AT12.14(GND) AT12.16(PUP2) AT12.17(PUP1) AT12.25(PAD) C1.2 C12.2 C16.2 C17.2 C19.2 C20.2 C21.2 C22.2 C26.2 C27.2 C32.2 C39.2 T1.1 U10.2(GND) U17.2(GND1) U17.4(GND2)
4V2_I: C1.1 C26.1 C27.1 C39.1 L1.1 U10.5(OUT)
CH1: C18.1 ; port CH1
CH1_DAD0: AT12.24(D0) ; port CH1_DAD0
CH1_DAD1: AT12.23(D1) ; port CH1_DAD1
CH1_DAD2: AT12.22(D2) ; port CH1_DAD2
CH1_DAD3: AT12.21(D3) ; port CH1_DAD3
CH1_DAD4: AT12.20(D4) ; port CH1_DAD4
CH1_DAD5: AT12.19(D5) ; port CH1_DAD5
CH1_DALE: AT12.4(LE) C19.1 ; port CH1_DALE
VIN_I+: C24.2 ; port VIN_I+
VIN_I-: C25.2 ; port VIN_I-
NetAT12_6: AT12.6(ATTIN) C18.2
NetAT12_7: AT12.7(ACG1) AT12.8(ACG2) AT12.9(ACG3) C17.1
NetAT12_10: AT12.10(ACG4) C21.1
NetAT12_11: AT12.11(ACG5) C20.1
NetAT12_12: AT12.12(ACG6) C22.1
NetAT12_13: AT12.13(ATTOUT) C15.1
NetC12_1: C12.1 U10.4(NR)
NetC15_2: C15.2 U17.1(RFIN)
NetC23_1: C23.1 L1.2 L8.2
NetC23_2: C23.2 T1.3
NetC24_1: C24.1 R2.1 T1.4
NetC25_1: C25.1 R2.2 T1.6
NetL8_1: L8.1 U17.3(RFOUT)

Not connected (* = marked no-connect by the designer): AT12 2(CLK) 3(SERIN) 15(SEROUT); T1 2

### Notes on the sheet
- 20 dB GAIN BLOCK
- FOR PLACEMENT REFER TO SIRENZA DATASHEET
- PROGRAMMABLE ATTENUATOR: 0dB to -31.5dB in 0.5dB Steps
- FROM 0dB ATTENUATOR
- BALUN
- 1. Place termination components at ADC
- PLACEMENT/ROUTING NOTES:
- 2. Route 25R (50R diff) from balun to R2
- 2009   THIS DOCUMENT IS THE PROPERTY OF THE OWNER, AND MAY NOT BE COPIED OR USED FOR ANY PURPOSE OTHER THAN THAT FOR WHICH IT IS SUPPLIED WITHOUT PERMISSION IN WRITING FROM THE OWNER.
- C
- DATESTAMP OF THIS PRINT
- DRAWN BY:
- DOCUMENT NUMBER:
- SCHEMATIC FILENAME:
- PCB FILENAME:
- ENGINEER:
- APPROVED:
- CIRCUIT DIAGRAM
- DATE
- SHEET
- REVISION
- OF

### Library data of the parts
AT12 = HMC624LP4: Broadband 6-bit IC Digital Attenuator; Manufacturer: Hittite; Created_By: IN; Checked_By: NN; Manufacturer_PN: HMC624LP4; Checked_Date: NN-08-2009; HelpURL: X:\Datasheets\By_Manufacturer\Hittite\hmc624lp4.pdf; ComponentLink1Description: Footprint Detail; ComponentLink1URL: X:\Datasheets\By_Manufacturer\Hittite\hmc624lp4.pdf#page=6; ComponentLink2Description: Application Note; ComponentLink2URL: *; ComponentLink3Description: Layout Guidelines; ComponentLink3URL: X:\Datasheets\By_Manufacturer\Hittite\hmc624lp4.pdf#page=9; ComponentLink4Description: Technology Reference; ComponentLink4URL: *; Supplier1: *; Supplier2: *; Unit_Cost: *; MOQ: *; Leadtime: *; Inventory_Stock: *; Tolerance: *; Wattage: *; Voltage: *; Package: QFN24; ComponentLink5Description: Production Detail; ComponentLink5URL: *; Note: *; Stock Code: *
C1 C15-C23 C26 C27 C39 = CAP-0603: CAP SMD 0603; Manufacturer: *; Manufacturer_PN: *; Created_By: *; Checked_By: *; Checked_Date: *; HelpURL: *; ComponentLink1Description: Footprint Detail; ComponentLink1URL: *; ComponentLink2Description: Application Note; ComponentLink2URL: *; ComponentLink3Description: Layout Guidelines; ComponentLink3URL: *; ComponentLink4Description: Technology Reference; ComponentLink4URL: *; Supplier1: *; Supplier2: *; Unit_Cost: *; MOQ: *; Leadtime: *; Inventory_Stock: *; Tolerance: *; Package: 0603; ComponentLink5Description: Production Detail; ComponentLink5URL: *; Note: *; Stock Code: *
  C1: Wattage: 10V
  C15-C23 C26 C27: Wattage: *; Voltage: *
  C39: Wattage: *
C12 C24 C25 C32 = cap0402: Created_By: EDA-ASA; Checked_By: *; Checked_Date: *; HelpURL: *; Supplier1: *; Supplier2: *; Unit_Cost: *; MOQ: *; Leadtime: *; Inventory_Stock: *; Tolerance: *; Wattage: *; Package: 0402; ComponentLinked1Description: *; ComponentLinked1URL: *; ComponentLinked2Description: *; ComponentLinked2URL: *; ComponentLinked3Description: *; ComponentLinked3URL: *; ComponentLinked4Description: *; ComponentLinked4URL: *
L1 L8 = CHOKE: Created_By: EDA-ASA; Checked_By: *; Checked_Date: *; HelpURL: *; ComponentLinked1Description: *; ComponentLinked1URL: *; ComponentLinked2Description: *; ComponentLinked2URL: *; ComponentLinked3Description: *; ComponentLinked3URL: *; ComponentLinked4Description: *; ComponentLinked4URL: *; Supplier1: *; Supplier2: *; Unit_Cost: *; MOQ: *; Leadtime: *; Inventory_Stock: *; Tolerance: *; Wattage: *
  L1: Value: 1200N
R2 = RES-0805: RESISTOR SMD 0805; Checked_By: NN; Manufacturer: *; Manufacturer_PN: *; Created_By: *; Checked_Date: 5-08-2009; HelpURL: *; ComponentLink1Description: Footprint Detail; ComponentLink1URL: *; ComponentLink2Description: Application Note; ComponentLink2URL: *; ComponentLink3Description: Layout Guidelines; ComponentLink3URL: *; ComponentLink4Description: Technology Reference; ComponentLink4URL: *; Supplier1: *; Supplier2: *; Unit_Cost: *; MOQ: *; Leadtime: *; Inventory_Stock: *; Tolerance: *; Wattage: *; Voltage: *; Package: 0805; ComponentLink5Description: Production Detail; ComponentLink5URL: *; Note: *; Stock Code: *
T1 = CX2156: as T3 on sheet ADC-EXTERNAL CLOCK INPUT; Manufacturer: *; Created_By: *; Checked_By: *; Checked_Date: *; HelpURL: *; ComponentLink1Description: TRANSFORMER WIDEBAND RF APPLICATION; ComponentLink1URL: *; ComponentLink2Description: Application Note; ComponentLink2URL: *; ComponentLink3Description: Layout Guidelines; ComponentLink3URL: *; ComponentLink4Description: Technology Reference; ComponentLink4URL: *; Supplier1: *; Supplier2: *; Unit_Cost: *; MOQ: *; Leadtime: *; Inventory_Stock: *; Tolerance: *; Wattage: *; Package: *; ComponentLink5Description: Production Detail; ComponentLink5URL: *; Note: *; Stock Code: *; Manufacturer_PN: CX2156
U10 = TPS7994DDCR: Low Quiescent Current, Ultra-Low Noise Dropout Linear Regulator; Manufacturer: TI; Created_By: IN; Manufacturer_PN: TPS7994DDCR; Checked_By: *; Checked_Date: *; HelpURL: X:\Datacheets\By_Manufacture\TI\296-17776-2.pdf; ComponentLink1Description: Footprint Detail; ComponentLink1URL: *; ComponentLink2Description: Application Note; ComponentLink2URL: *; ComponentLink3Description: Layout Guidelines; ComponentLink3URL: *; ComponentLink4Description: Technology Reference; ComponentLink4URL: *; Supplier1: *; Supplier2: *; Unit_Cost: *; MOQ: *; Leadtime: *; Inventory_Stock: *; Tolerance: *; Wattage: *; Voltage: *; Package: *; ComponentLink5Description: Production Detail; ComponentLink5URL: *; Note: *; Stock Code: *
U17 = SBB-2089Z: High performance InaGaP HBT MMIC amplfier; Manufacturer: Sirenza Micodevices; Created_By: IN; Manufacturer_PN: SBB-2089Z; Checked_By: *; Checked_Date: *; HelpURL: X:\Datasheets\By_Manufacturer\Sirenza\SBB-2089(Z)_Datasheet.pdf; ComponentLink1Description: Footprint Detail; ComponentLink1URL: X:\Datasheets\By_Manufacturer\Sirenza\SBB-2089(Z)_Datasheet.pdf#Page=5; ComponentLink2Description: Application Note; ComponentLink2URL: *; ComponentLink3Description: Layout Guidelines; ComponentLink3URL: *; ComponentLink4Description: Technology Reference; ComponentLink4URL: *; Supplier1: *; Supplier2: *; Unit_Cost: *; MOQ: *; Leadtime: *; Inventory_Stock: *; Tolerance: *; Wattage: *; Voltage: *; Package: *; ComponentLink5Description: Production Detail; ComponentLink5URL: *; Note: *; Stock Code: *

## Sheet ADC-LOGIC LEVEL CONVERTERS.SchDoc: <SPECIFIC SHEET FUNCTION>
size A3; Date: DO NOT USE, RATHER USE PROJ OPTIONS; DrawnBy: DO NOT USE, RATHER USE PROJ OPTIONS; Engineer: DO NOT USE, RATHER USE PROJ OPTIONS; Organization: DO NOT USE, RATHER USE PROJ OPTIONS; DocumentNumber: 8; Revision: DO NOT USE, RATHER USE PROJ OPTIONS; SheetNumber: 8; SheetTotal: 12; SCH_Sheet_Filename: ADC-LOGIC LEVEL CONVERTERS.SchDoc; CurrentTime: DO NOT USE, RATHER USE PROJ OPTIONS; Time: DO NOT USE, RATHER USE PROJ OPTIONS; DocumentFullPathAndName: DO NOT USE, RATHER USE PROJ OPTIONS; DocumentName: DO NOT USE, RATHER USE PROJ OPTIONS; ModifiedDate: DO NOT USE, RATHER USE PROJ OPTIONS; ImagePath: DO NOT USE, RATHER USE PROJ OPTIONS
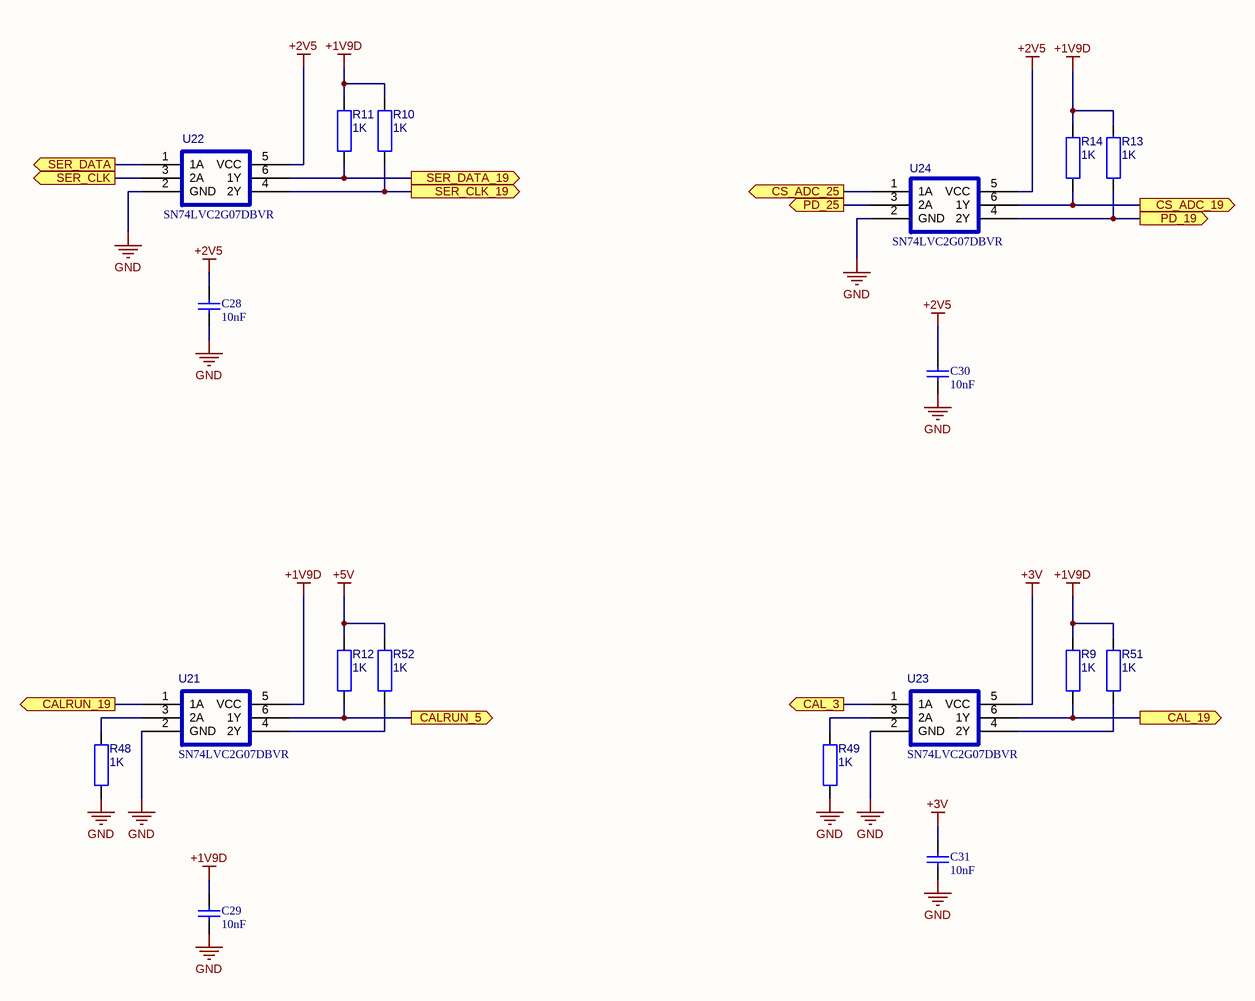
[diagram p4: ADC-LOGIC LEVEL CONVERTERS.SchDoc]

### Parts
C28  value 10nF  [CAPC1005X55N]  (hidden comment: Capacitor 0402 SMD)
C29  value 10nF  [CAPC1005X55N]  (hidden comment: Capacitor 0402 SMD)
C30  value 10nF  [CAPC1005X55N]  (hidden comment: Capacitor 0402 SMD)
C31  value 10nF  [CAPC1005X55N]  (hidden comment: Capacitor 0402 SMD)
R9  1K  [0603]
R10  1K  [0603]
R11  1K  [0603]
R12  1K  [0603]
R13  1K  [0603]
R14  1K  [0603]
R48  1K  [0603]
R49  1K  [0603]
R51  1K  [0603]
R52  1K  [0603]
U21  SN74LVC2G07DBVR  [SOT95P280X145-6N]
U22  SN74LVC2G07DBVR  [SOT95P280X145-6N]
U23  SN74LVC2G07DBVR  [SOT95P280X145-6N]
U24  SN74LVC2G07DBVR  [SOT95P280X145-6N]

### Ports
CAL_3 (out), CAL_19 (out), CALRUN_5 (out), CALRUN_19 (out), CS_ADC_19 (out), CS_ADC_25 (out), PD_19 (out), PD_25 (out), SER_CLK (out), SER_CLK_19 (out), SER_DATA (out), SER_DATA_19 (out)

### Nets
+1V9D: C29.2 R9.1 R10.1 R11.1 R13.1 R14.1 R51.1 U21.5(VCC)
+2V5: C28.2 C30.2 U22.5(VCC) U24.5(VCC)
+3V: C31.2 U23.5(VCC)
+5V: R12.1 R52.1
GND: C28.1 C29.1 C30.1 C31.1 R48.2 R49.2 U21.2(GND) U22.2(GND) U23.2(GND) U24.2(GND)
CAL_3: U23.1(1A) ; port CAL_3
CAL_19: R9.2 U23.6(1Y) ; port CAL_19
CALRUN_5: R12.2 U21.6(1Y) ; port CALRUN_5
CALRUN_19: U21.1(1A) ; port CALRUN_19
CS_ADC_19: R14.2 U24.6(1Y) ; port CS_ADC_19
CS_ADC_25: U24.1(1A) ; port CS_ADC_25
PD_19: R13.2 U24.4(2Y) ; port PD_19
PD_25: U24.3(2A) ; port PD_25
SER_CLK: U22.3(2A) ; port SER_CLK
SER_CLK_19: R10.2 U22.4(2Y) ; port SER_CLK_19
SER_DATA: U22.1(1A) ; port SER_DATA
SER_DATA_19: R11.2 U22.6(1Y) ; port SER_DATA_19
NetR48_1: R48.1 U21.3(2A)
NetR49_1: R49.1 U23.3(2A)
NetR51_2: R51.2 U23.4(2Y)
NetR52_2: R52.2 U21.4(2Y)

### Notes on the sheet
- 2009   THIS DOCUMENT IS THE PROPERTY OF THE OWNER, AND MAY NOT BE COPIED OR USED FOR ANY PURPOSE OTHER THAN THAT FOR WHICH IT IS SUPPLIED WITHOUT PERMISSION IN WRITING FROM THE OWNER.
- C
- DATESTAMP OF THIS PRINT
- DRAWN BY:
- DOCUMENT NUMBER:
- SCHEMATIC FILENAME:
- PCB FILENAME:
- ENGINEER:
- APPROVED:
- CIRCUIT DIAGRAM
- DATE
- SHEET
- REVISION
- OF

### Library data of the parts
C28-C31 = cap0402: Created_By: EDA-ASA; Checked_By: *; Checked_Date: *; HelpURL: *; Supplier1: *; Supplier2: *; Unit_Cost: *; MOQ: *; Leadtime: *; Inventory_Stock: *; Tolerance: *; Wattage: *; Package: 0402; ComponentLinked1Description: *; ComponentLinked1URL: *; ComponentLinked2Description: *; ComponentLinked2URL: *; ComponentLinked3Description: *; ComponentLinked3URL: *; ComponentLinked4Description: *; ComponentLinked4URL: *
R9-R14 R48 R49 R51 R52 = RES-0805: RESISTOR SMD 0805; Checked_By: NN; Manufacturer: *; Manufacturer_PN: *; Created_By: *; Checked_Date: 5-08-2009; HelpURL: *; ComponentLink1Description: Footprint Detail; ComponentLink1URL: *; ComponentLink2Description: Application Note; ComponentLink2URL: *; ComponentLink3Description: Layout Guidelines; ComponentLink3URL: *; ComponentLink4Description: Technology Reference; ComponentLink4URL: *; Supplier1: *; Supplier2: *; Unit_Cost: *; MOQ: *; Leadtime: *; Inventory_Stock: *; Tolerance: *; Wattage: *; Voltage: *; Package: 0805; ComponentLink5Description: Production Detail; ComponentLink5URL: *; Note: *; Stock Code: *; Value: 1K
U21-U24 = SN74LVC2G07DBVR: Dual Buffer/Driver with open-drain output; Manufacturer: TI; Created_By: IN; Manufacturer_PN: SN74LVC2G07DBVR; Checked_By: *; Checked_Date: *; HelpURL: X:\Datasheets\By_Manufacturer\TI\sn74lvc2g07.pdf; ComponentLink1Description: Footprint Detail; ComponentLink2Description: Application Note; ComponentLink2URL: *; ComponentLink3Description: Layout Guidelines; ComponentLink3URL: *; ComponentLink4Description: Technology Reference; ComponentLink4URL: *; Supplier1: *; Supplier2: *; Unit_Cost: *; MOQ: *; Leadtime: *; Inventory_Stock: *; Tolerance: *; Wattage: *; Voltage: *; Package: *; ComponentLink5Description: Production Detail; ComponentLink5URL: *; Note: *; Stock Code: *

## Sheet ADC-Peripherals.SchDoc: <SPECIFIC SHEET FUNCTION>
size A3; Date: DO NOT USE, RATHER USE PROJ OPTIONS; DrawnBy: DO NOT USE, RATHER USE PROJ OPTIONS; Engineer: DO NOT USE, RATHER USE PROJ OPTIONS; Organization: DO NOT USE, RATHER USE PROJ OPTIONS; DocumentNumber: 5; Revision: DO NOT USE, RATHER USE PROJ OPTIONS; SheetNumber: 5; SheetTotal: 12; SCH_Sheet_Filename: ADC-Peripherals.SchDoc; CurrentTime: DO NOT USE, RATHER USE PROJ OPTIONS; Time: DO NOT USE, RATHER USE PROJ OPTIONS; DocumentFullPathAndName: DO NOT USE, RATHER USE PROJ OPTIONS; DocumentName: DO NOT USE, RATHER USE PROJ OPTIONS; ModifiedDate: DO NOT USE, RATHER USE PROJ OPTIONS; ImagePath: DO NOT USE, RATHER USE PROJ OPTIONS
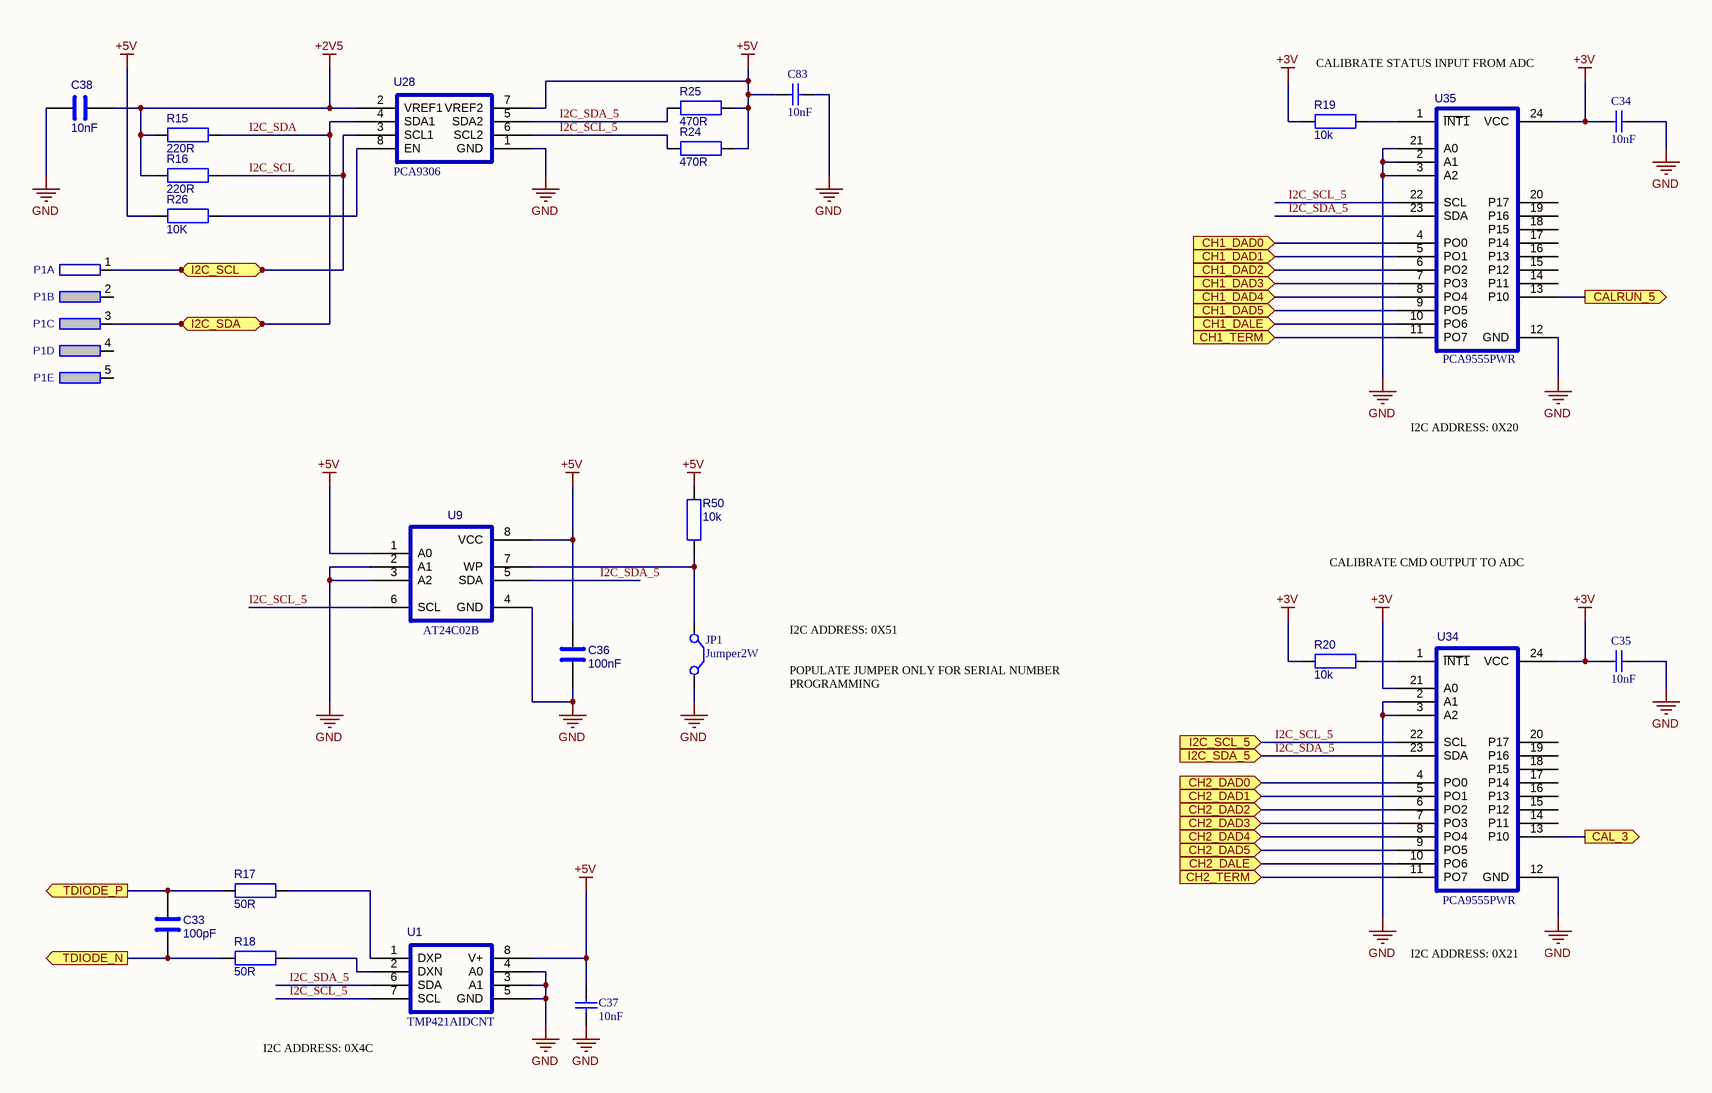
[diagram p5: ADC-Peripherals.SchDoc]

### Parts
C33  value 100pF  [CAPC1005X55N]  (hidden comment: *)
C34  value 10nF  [CAPC1005X55N]  (hidden comment: Capacitor 0402 SMD)
C35  value 10nF  [CAPC1005X55N]  (hidden comment: Capacitor 0402 SMD)
C36  100nF  [CAPC1005X55N]
C37  value 10nF  [CAPC1005X55N]  (hidden comment: Capacitor 0402 SMD)
C38  10nF  [CAPC1005X55N]
C83  value 10nF  [CAPC1005X55N]  (hidden comment: Capacitor 0402 SMD)
JP1  Jumper2W  [JP-100MIL]
P1  SAMTEC-TSM-105-01-TM-SV-5W-HDR  [TSM_5X1_SV]  (value not drawn)  (parts A,B,C,D,E of 5)
R15  220R  [0603]
R16  220R  [0603]
R17  value 50R  [RESC1005X40N]  (hidden comment: *)
R18  50R  [RESC1005X40N]
R19  10k  [0603]
R20  10k  [0603]
R24  470R  [0603]
R25  470R  [0603]
R26  10K  [0603]
R50  value 10k  [0603]  (hidden comment: *)
U1  TMP421AIDCNT  [TI_SOT23-8]
U9  AT24C02B  [SOIC127P600X175-8N]
U28  PCA9306  [SOP65P400X130-8USR]
U34  PCA9555PWR  [TI_TSSOP24]
U35  PCA9555PWR  [TI_TSSOP24]

### Ports
CAL_3 (out), CALRUN_5 (out), CH1_DAD0 (in), CH1_DAD1 (in), CH1_DAD2 (in), CH1_DAD3 (in), CH1_DAD4 (in), CH1_DAD5 (in), CH1_DALE (in), CH1_TERM (in), CH2_DAD0 (in), CH2_DAD1 (in), CH2_DAD2 (in), CH2_DAD3 (in), CH2_DAD4 (in), CH2_DAD5 (in), CH2_DALE (in), CH2_TERM (in), I2C_SCL, I2C_SCL_5 (in), I2C_SDA, I2C_SDA_5 (in), TDIODE_N (out), TDIODE_P (out)

### Nets
+2V5: C38.2 R15.1 R16.1 U28.2(VREF1)
+3V: C34.1 C35.1 R19.1 R20.1 U34.21(A0) U34.24(VCC) U35.24(VCC)
+5V: C36.1 C37.2 C83.1 R24.2 R25.2 R26.2 R50.1 U1.8(V+) U9.1(A0) U9.8(VCC) U28.7(VREF2)
GND: C34.2 C35.2 C36.2 C37.1 C38.1 C83.2 JP1.2(C2) U1.3(A1) U1.4(A0) U1.5(GND) U9.2(A1) U9.3(A2) U9.4(GND) U28.1(GND) U34.2(A1) U34.3(A2) U34.12(GND) U35.2(A1) U35.3(A2) U35.12(GND) U35.21(A0)
CAL_3: U34.13(P10) ; port CAL_3
CALRUN_5: U35.13(P10) ; port CALRUN_5
CH1_DAD0: U35.4(PO0) ; port CH1_DAD0
CH1_DAD1: U35.5(PO1) ; port CH1_DAD1
CH1_DAD2: U35.6(PO2) ; port CH1_DAD2
CH1_DAD3: U35.7(PO3) ; port CH1_DAD3
CH1_DAD4: U35.8(PO4) ; port CH1_DAD4
CH1_DAD5: U35.9(PO5) ; port CH1_DAD5
CH1_DALE: U35.10(PO6) ; port CH1_DALE
CH1_TERM: U35.11(PO7) ; port CH1_TERM
CH2_DAD0: U34.4(PO0) ; port CH2_DAD0
CH2_DAD1: U34.5(PO1) ; port CH2_DAD1
CH2_DAD2: U34.6(PO2) ; port CH2_DAD2
CH2_DAD3: U34.7(PO3) ; port CH2_DAD3
CH2_DAD4: U34.8(PO4) ; port CH2_DAD4
CH2_DAD5: U34.9(PO5) ; port CH2_DAD5
CH2_DALE: U34.10(PO6) ; port CH2_DALE
CH2_TERM: U34.11(PO7) ; port CH2_TERM
I2C_SCL: P1.1 R16.2 U28.3(SCL1) ; port I2C_SCL
I2C_SCL_5: R24.1 U1.7(SCL) U9.6(SCL) U28.6(SCL2) U34.22(SCL) U35.22(SCL) ; port I2C_SCL_5
I2C_SDA: P1.3 R15.2 U28.4(SDA1) ; port I2C_SDA
I2C_SDA_5: R25.1 U1.6(SDA) U9.5(SDA) U28.5(SDA2) U34.23(SDA) U35.23(SDA) ; port I2C_SDA_5
TDIODE_N: C33.2 R18.2 ; port TDIODE_N
TDIODE_P: C33.1 R17.2 ; port TDIODE_P
NetJP1_1: JP1.1(C1) R50.2 U9.7(WP)
NetR17_1: R17.1 U1.1(DXP)
NetR18_1: R18.1 U1.2(DXN)
NetR19_2: R19.2 U35.1(~{INT1})
NetR20_2: R20.2 U34.1(~{INT1})
NetR26_1: R26.1 U28.8(EN)

Not connected (* = marked no-connect by the designer): P1 2 4 5; U34 14(P11) 15(P12) 16(P13) 17(P14) 18(P15) 19(P16) 20(P17); U35 14(P11) 15(P12) 16(P13) 17(P14) 18(P15) 19(P16) 20(P17)

### Notes on the sheet
- CALIBRATE STATUS INPUT FROM ADC
- I2C ADDRESS: 0X20
- CALIBRATE CMD OUTPUT TO ADC
- I2C ADDRESS: 0X51
- POPULATE JUMPER ONLY FOR SERIAL NUMBER PROGRAMMING
- I2C ADDRESS: 0X21
- (near U1) I2C ADDRESS: 0X4C
- 2009   THIS DOCUMENT IS THE PROPERTY OF THE OWNER, AND MAY NOT BE COPIED OR USED FOR ANY PURPOSE OTHER THAN THAT FOR WHICH IT IS SUPPLIED WITHOUT PERMISSION IN WRITING FROM THE OWNER.
- C
- DATESTAMP OF THIS PRINT
- DRAWN BY:
- DOCUMENT NUMBER:
- SCHEMATIC FILENAME:
- PCB FILENAME:
- ENGINEER:
- APPROVED:
- CIRCUIT DIAGRAM
- DATE
- SHEET
- REVISION
- OF

### Library data of the parts
C33 C36 C38 = CAP-0603: CAP SMD 0603; Manufacturer: *; Manufacturer_PN: *; Created_By: *; Checked_By: *; Checked_Date: *; HelpURL: *; ComponentLink1Description: Footprint Detail; ComponentLink1URL: *; ComponentLink2Description: Application Note; ComponentLink2URL: *; ComponentLink3Description: Layout Guidelines; ComponentLink3URL: *; ComponentLink4Description: Technology Reference; ComponentLink4URL: *; Supplier1: *; Supplier2: *; Unit_Cost: *; MOQ: *; Leadtime: *; Inventory_Stock: *; Tolerance: *; Wattage: *; Voltage: *; Package: 0603; ComponentLink5Description: Production Detail; ComponentLink5URL: *; Note: *; Stock Code: *
  C36: Value: 100nF
  C38: Value: 10nF
C34 C35 C37 C83 = cap0402: Created_By: EDA-ASA; Checked_By: *; Checked_Date: *; HelpURL: *; Supplier1: *; Supplier2: *; Unit_Cost: *; MOQ: *; Leadtime: *; Inventory_Stock: *; Tolerance: *; Wattage: *; Package: 0402; ComponentLinked1Description: *; ComponentLinked1URL: *; ComponentLinked2Description: *; ComponentLinked2URL: *; ComponentLinked3Description: *; ComponentLinked3URL: *; ComponentLinked4Description: *; ComponentLinked4URL: *
JP1 = Jumper2W: Jumper Wire; Published: 24-Mar-1999; LatestRevisionDate: 17-Jul-2002; LatestRevisionNote: Re-released for DXP Platform.; PackageReference: RAD-0.2; Publisher: Altium Limited
P1 = SAMTEC-TSM-105-01-TM-SV-5W-HDR: Value: {Value}
R15-R20 R24-R26 R50 = RES-0805: RESISTOR SMD 0805; Checked_By: NN; Manufacturer: *; Manufacturer_PN: *; Created_By: *; Checked_Date: 5-08-2009; HelpURL: *; ComponentLink1Description: Footprint Detail; ComponentLink1URL: *; ComponentLink2Description: Application Note; ComponentLink2URL: *; ComponentLink3Description: Layout Guidelines; ComponentLink3URL: *; ComponentLink4Description: Technology Reference; ComponentLink4URL: *; Supplier1: *; Supplier2: *; Unit_Cost: *; MOQ: *; Leadtime: *; Inventory_Stock: *; Tolerance: *; Wattage: *; Voltage: *; Package: 0805; ComponentLink5Description: Production Detail; ComponentLink5URL: *; Note: *; Stock Code: *
  R15 R16: Value: 220R
  R18: Value: 50R
  R19 R20: Value: 10k
  R24 R25: Value: 470R
  R26: Value: 10K
U1 = TMP421AIDCNT: Remote and Local TempreatureSensor in SOT23-8; Manufacturer: TI; Manufacturer_PN: TMP421AIDCNT; Created_By: IN; Checked_By: *; Checked_Date: *; HelpURL: X:Datasheets\By_Manufacturer\TI\tmp421.pdf; ComponentLink1Description: Footprint Detail; ComponentLink1URL: X:Datasheets\By_Manufacturer\TI\tmp421.pdf; ComponentLink2Description: Application Note; ComponentLink2URL: *; ComponentLink3Description: Layout Guidelines; ComponentLink3URL: *; ComponentLink4Description: Technology Reference; ComponentLink4URL: *; Supplier1: *; Supplier2: *; Unit_Cost: *; MOQ: *; Leadtime: *; Inventory_Stock: *; Tolerance: *; Wattage: *; Voltage: *; Package: *; ComponentLink5Description: Production Detail; ComponentLink5URL: *; Note: *; Stock Code: *
U9 = AT24C02B: Two wire Serial EEPROM 2K (256 x 8); Manufacturer: Atmel; Created_By: IN; Manufacturer_PN: AT24C02B; Checked_By: *; Checked_Date: *; HelpURL: X:\Datasheets\By_Manufacturer\ATMEL\at24c02b.pdf; ComponentLink1Description: Footprint Detail; ComponentLink1URL: *; ComponentLink2Description: Application Note; ComponentLink2URL: *; ComponentLink3Description: Layout Guidelines; ComponentLink3URL: *; ComponentLink4Description: Technology Reference; ComponentLink4URL: *; Supplier1: *; Supplier2: *; Unit_Cost: *; MOQ: *; Leadtime: *; Inventory_Stock: *; Tolerance: *; Wattage: *; Voltage: *; Package: *; ComponentLink5Description: Production Detail; ComponentLink5URL: *; Note: *; Stock Code: *
U28 = PCA9306DCTR: Dual Bidirectional I2C Bus and SMBus Voltage-Level Translator; Manufacturer: TI; Created_By: IN; Manufacturer_PN: PCA9306; Checked_By: *; Checked_Date: *; HelpURL: X:\Datasheets\By_Manufacturer\TI\pca9306.pdf; ComponentLink1Description: Footprint Detail; ComponentLink1URL: *; ComponentLink2Description: Application Note; ComponentLink2URL: *; ComponentLink3Description: Layout Guidelines; ComponentLink3URL: *; ComponentLink4Description: Technology Reference; ComponentLink4URL: *; Supplier1: *; Supplier2: *; Unit_Cost: *; MOQ: *; Leadtime: *; Inventory_Stock: *; Tolerance: *; Wattage: *; Voltage: *; Package: *; ComponentLink5Description: Production Detail; ComponentLink5URL: *; Note: *; Stock Code: *
U34 U35 = PCA9555PWR: Remote 16-Bit I2C and SMBus  I/O expander; Manufacturer: TI; Created_By: IN; Manufacturer_PN: PCA9555PWR; Checked_By: *; Checked_Date: *; HelpURL: X:\Datasheets\By_Manufacturer\TI\pca9555.pdf; ComponentLink1Description: X:\Datasheets\By_Manufacturer\TI\pca9555.pdf#page=22; ComponentLink1URL: *; ComponentLink2Description: Application Note; ComponentLink2URL: *; ComponentLink3Description: Layout Guidelines; ComponentLink3URL: *; ComponentLink4Description: Technology Reference; ComponentLink4URL: *; Supplier1: *; Supplier2: *; Unit_Cost: *; MOQ: *; Leadtime: *; Inventory_Stock: *; Tolerance: *; Wattage: *; Voltage: *; Package: *; ComponentLink5Description: Production Detail; ComponentLink5URL: *; Note: *; Stock Code: *